# EAGLE design foxcar-control-board-v1 (EAGLE 6.4)

## Sheet 1 of 2
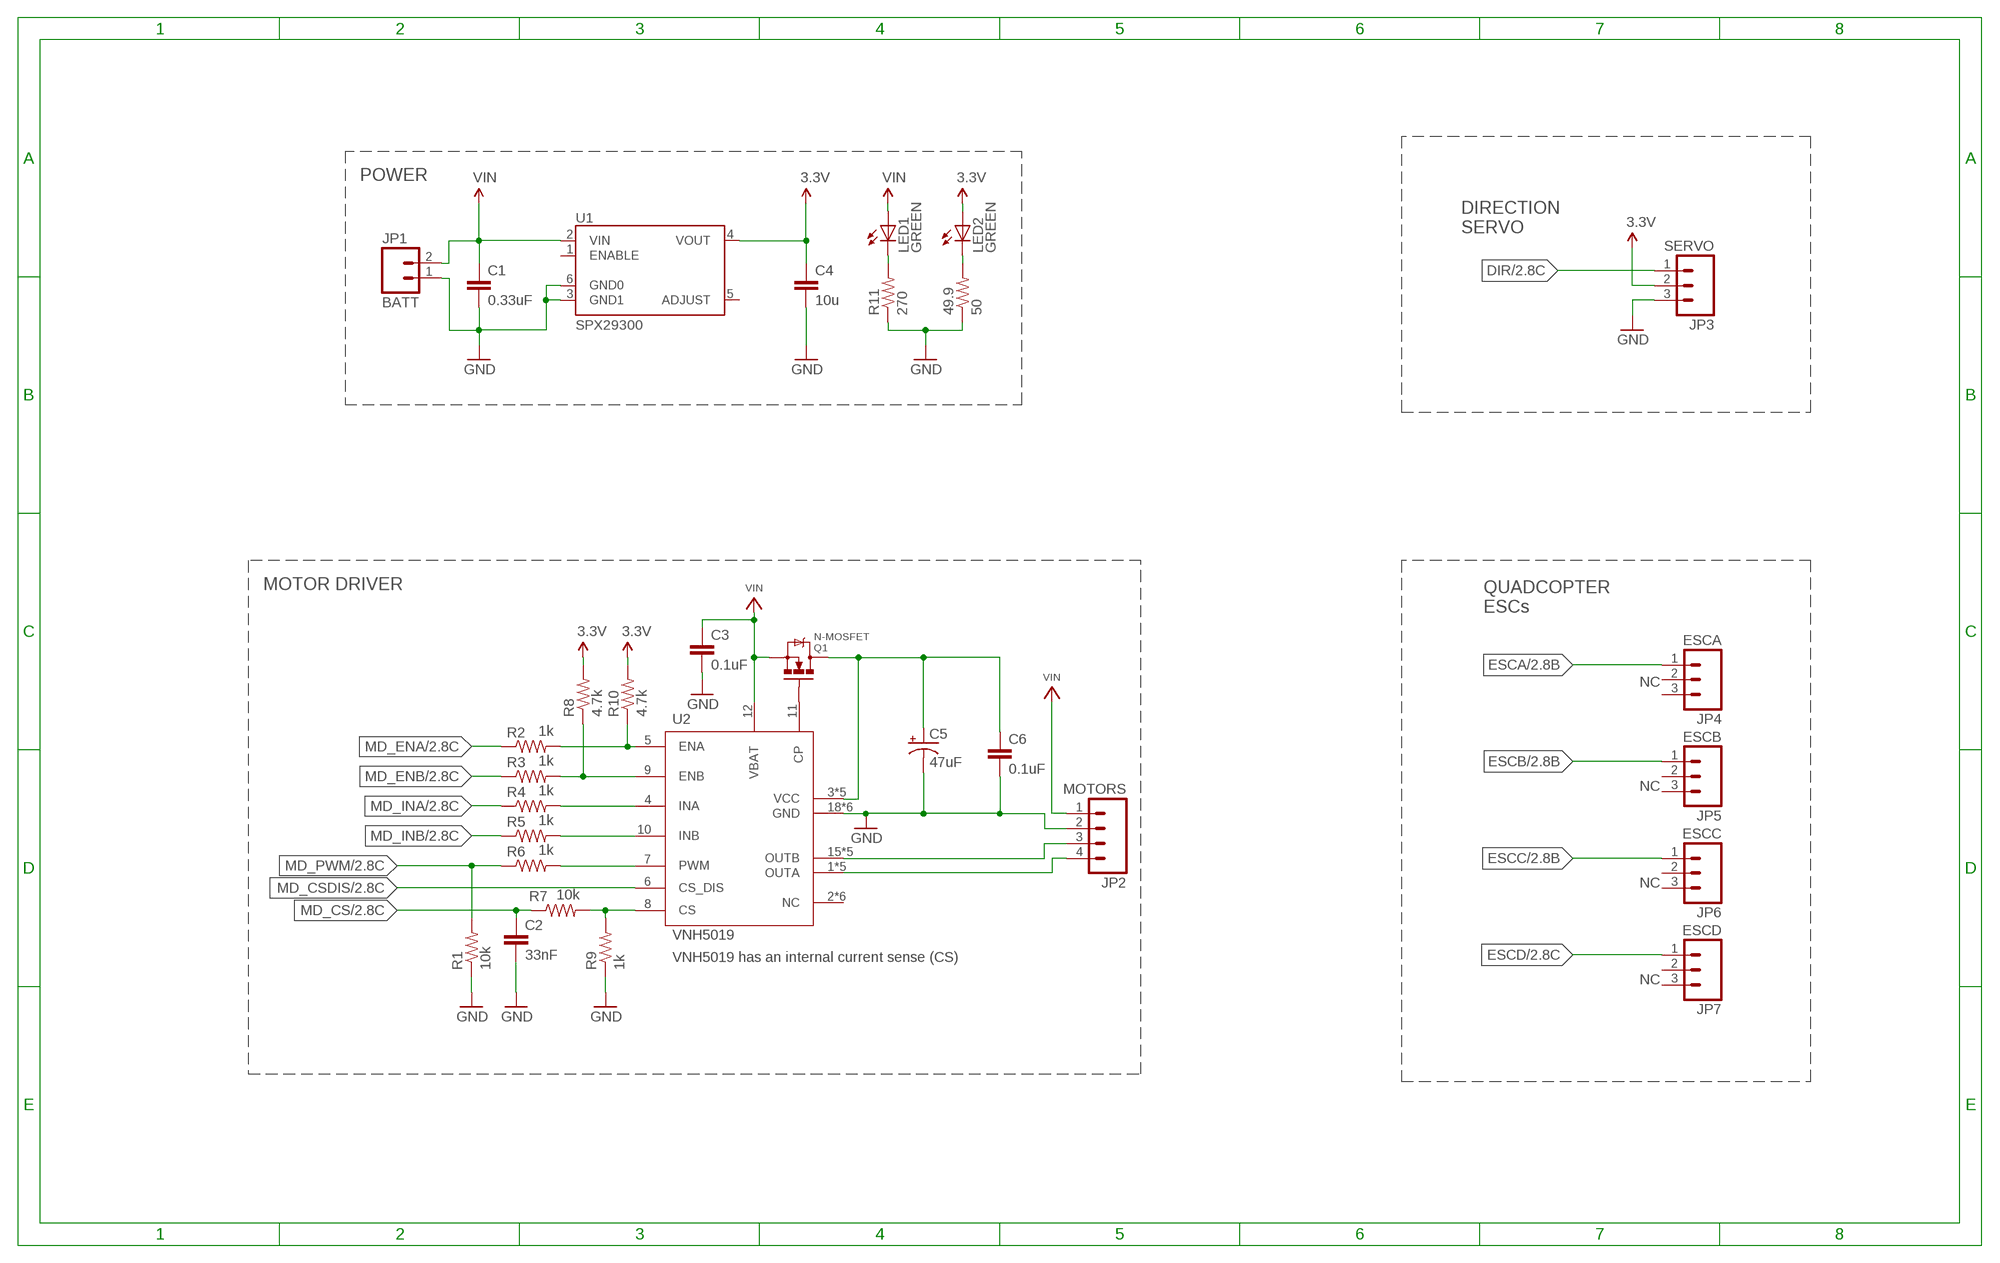
[diagram p0: schematic, sheet 1]

### Parts
49.9  50  RESISTOR0402-RES  [0402-RES]
C1  0.33uF  CAP0402-CAP  [0402-CAP]
C2  33nF  CAP0402-CAP  [0402-CAP]
C3  0.1uF  CAP0402-CAP  [0402-CAP]
C4  10u  CAP0603-CAP  [0603-CAP]
C5  47uF  CAP_POLD  [PANASONIC_D]
C6  0.1uF  CAP0402-CAP  [0402-CAP]
JP1  BATT  M023.5MM_LOCK  [SCREWTERMINAL-3.5MM-2_LOCK]
JP2  MOTORS  M04SCREW_LOCK  [SCREWTERMINAL-3.5MM-4_LOCK]
JP3  SERVO  M03LOCK_LONGPADS  [1X03_LOCK_LONGPADS]
JP4  ESCA  M03LOCK_LONGPADS  [1X03_LOCK_LONGPADS]
JP5  ESCB  M03LOCK_LONGPADS  [1X03_LOCK_LONGPADS]
JP6  ESCC  M03LOCK_LONGPADS  [1X03_LOCK_LONGPADS]
JP7  ESCD  M03LOCK_LONGPADS  [1X03_LOCK_LONGPADS]
LED1  GREEN  LEDCHIPLED_0603  [CHIPLED_0603]
LED2  GREEN  LEDCHIPLED_0603  [CHIPLED_0603]
Q1  N-MOSFET  MOSFET-NCHANNELPTH2  [TO220V]
R1  10k  RESISTOR0603-RES  [0603-RES]
R2  1k  RESISTOR0402-RES  [0402-RES]
R3  1k  RESISTOR0402-RES  [0402-RES]
R4  1k  RESISTOR0402-RES  [0402-RES]
R5  1k  RESISTOR0402-RES  [0402-RES]
R6  1k  RESISTOR0402-RES  [0402-RES]
R7  10k  RESISTOR0402-RES  [0402-RES]
R8  4.7k  RESISTOR0402-RES  [0402-RES]
R9  1k  RESISTOR0402-RES  [0402-RES]
R10  4.7k  RESISTOR0402-RES  [0402-RES]
R11  270  RESISTOR0603-RES  [0603-RES]
U1  SPX29300  VREG_TO263-5  [TO263-5]
U2  VNH5019  [MULTIPOWERSO-30]

### Nets
3.3V: C4.1 JP3.2 LED2.A R8.2 R10.2 U1.4(VOUT) ; also sheet 2
CP: Q1.1(G) U2.11(CP)
CS: R7.2 R9.2 U2.8(CS)
DIR: JP3.1 ; also sheet 2
ENA: R2.2 R10.1 U2.5(ENA)
ENB: R3.2 R8.1 U2.9(ENB)
ESCA: JP4.1 ; also sheet 2
ESCB: JP5.1 ; also sheet 2
ESCC: JP6.1 ; also sheet 2
ESCD: JP7.1 ; also sheet 2
GND: 49.9.1 C1.2 C2.2 C3.2 C4.2 C5.- C6.2 JP1.1 JP2.2 JP3.3 R1.1 R9.1 R11.1 U1.3(GND1) U1.6(GND0) U2.18(GND) U2.19(GND) U2.20(GND) U2.26(GND) U2.27(GND) U2.28(GND) ; also sheet 2
INA: R4.2 U2.4(INA)
INB: R5.2 U2.10(INB)
MD_CS: C2.1 R7.1 ; also sheet 2
MD_CSDIS: U2.6(CS_DIS) ; also sheet 2
MD_ENA: R2.1 ; also sheet 2
MD_ENB: R3.1 ; also sheet 2
MD_INA: R4.1 ; also sheet 2
MD_INB: R5.1 ; also sheet 2
MD_PWM: R1.2 R6.1 ; also sheet 2
N$2: 49.9.2 LED2.C
N$3: LED1.C R11.2
OUTA: JP2.4 U2.1(OUTA) U2.25(OUTA) U2.30(OUTA) U2.OUTA U2.OUTA@1(OUTA)
OUTB: JP2.3 U2.15(OUTB) U2.16(OUTB) U2.21(OUTB) U2.OUTB U2.OUTB@1(OUTB)
PWM: R6.2 U2.7(PWM)
VCC: C5.+ C6.1 Q1.2(D) U2.3(VCC) U2.13(VCC) U2.23(VCC) U2.VCC U2.VCC@1(VCC)
VIN: C1.1 C3.1 JP1.2 JP2.1 LED1.A Q1.3(S) U1.2(VIN) U2.12(VBAT) ; also sheet 2
Unconnected: JP4.2 JP4.3 JP5.2 JP5.3 JP6.2 JP6.3 JP7.2 JP7.3 U1.1(ENABLE) U1.5(ADJUST) U2.2(NC) U2.14(NC) U2.17(NC) U2.22(NC) U2.24(NC) U2.29(NC)

### Notes on the sheet
- POWER
- DIRECTION
  SERVO
- MOTOR DRIVER
- QUADCOPTER
  ESCs
- NC
- NC
- NC
- VNH5019 has an internal current sense (CS)
- NC

## Sheet 2 of 2
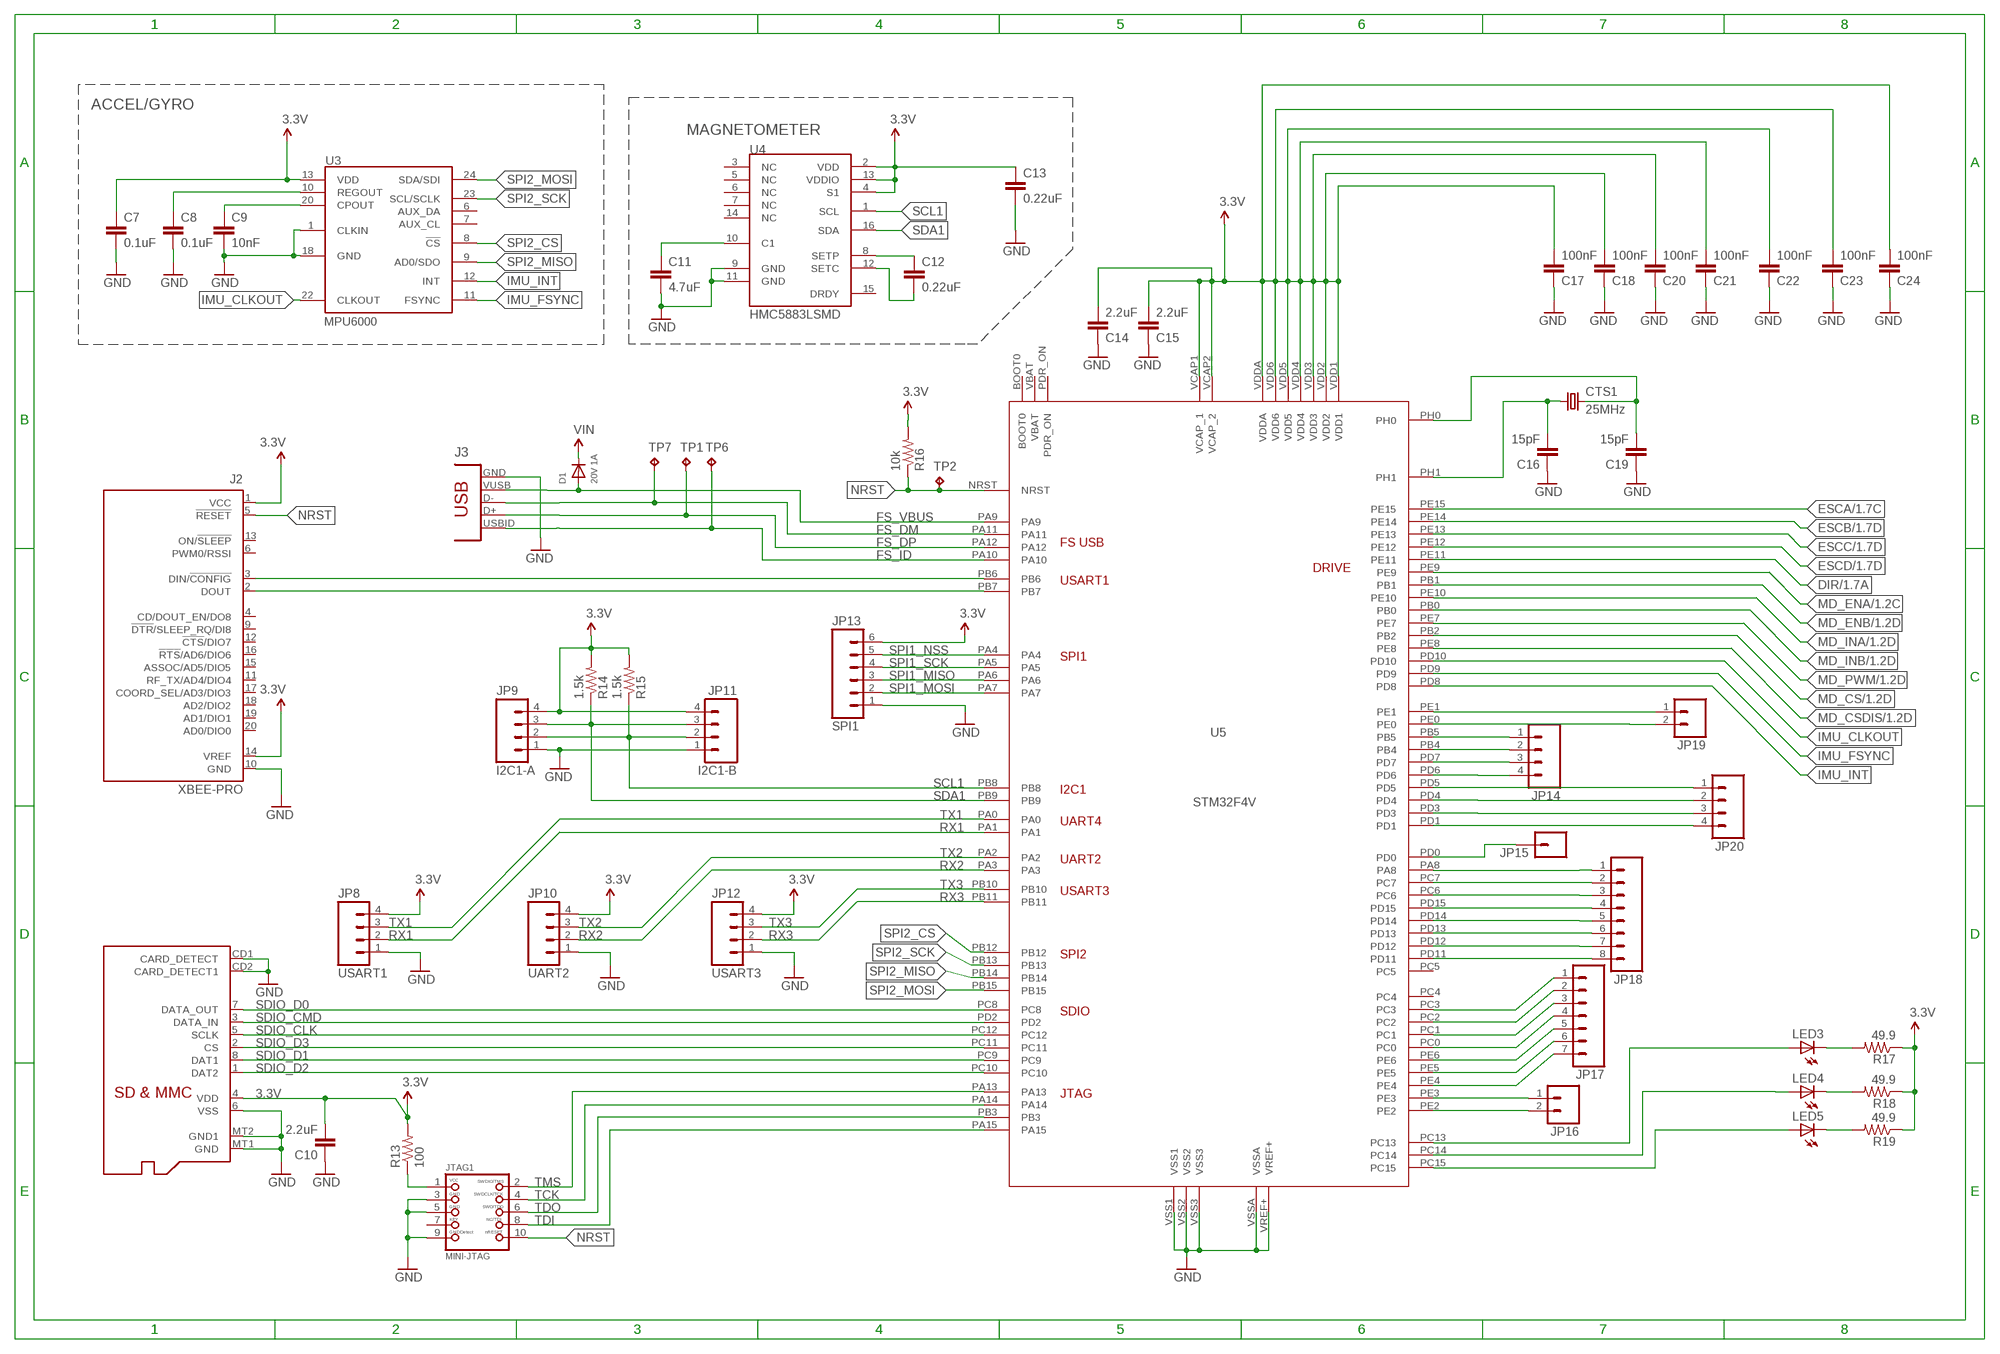
[diagram p1: schematic, sheet 2]

### Parts
C7  0.1uF  CAP0402-CAP  [0402-CAP]
C8  0.1uF  CAP0402-CAP  [0402-CAP]
C9  10nF  CAP0402-CAP  [0402-CAP]
C10  2.2uF  CAP0402-CAP  [0402-CAP]
C11  4.7uF  CAP0402-CAP  [0402-CAP]
C12  0.22uF  CAP0402-CAP  [0402-CAP]
C13  0.22uF  CAP0402-CAP  [0402-CAP]
C14  2.2uF  CAP0402-CAP  [0402-CAP]
C15  2.2uF  CAP0402-CAP  [0402-CAP]
C16  15pF  CAP0402-CAP  [0402-CAP]
C17  100nF  CAP0402-CAP  [0402-CAP]
C18  100nF  CAP0402-CAP  [0402-CAP]
C19  15pF  CAP0402-CAP  [0402-CAP]
C20  100nF  CAP0402-CAP  [0402-CAP]
C21  100nF  CAP0402-CAP  [0402-CAP]
C22  100nF  CAP0402-CAP  [0402-CAP]
C23  100nF  CAP0402-CAP  [0402-CAP]
C24  100nF  CAP0402-CAP  [0402-CAP]
CTS1  25MHz  CRYSTALCTS406  [CTS406]
D1  20V 1A  DIODESMA  [SMADIODE]
J1  MICROSD  [MICROSD]
J2  XBEE-PRO  [XBEE-PRO]
J3  CON-USB-F-MICRO-B  [CONN_USB_MICRO-B]
JP8  USART1  M04LOCK_LONGPADS  [1X04_LOCK_LONGPADS]
JP9  I2C1-A  M04LOCK_LONGPADS  [1X04_LOCK_LONGPADS]
JP10  UART2  M04LOCK_LONGPADS  [1X04_LOCK_LONGPADS]
JP11  I2C1-B  M04LOCK_LONGPADS  [1X04_LOCK_LONGPADS]
JP12  USART3  M04LOCK_LONGPADS  [1X04_LOCK_LONGPADS]
JP13  SPI1  M06LOCK_LONGPADS  [1X06_LOCK_LONGPADS]
JP14  M04LOCK  [1X04_LOCK]
JP15  M01PTH  [1X01]
JP16  M02LOCK_LONGPADS  [1X02_LOCK_LONGPADS]
JP17  M07LOCK  [1X07_LOCK]
JP18  M08LOCK_LONGPADS  [1X08_LOCK_LONGPADS]
JP19  M02LOCK  [1X02_LOCK]
JP20  M04LOCK  [1X04_LOCK]
JTAG1  MINI-JTAG  JTAG-CORTEXM3  [2X05_1.27MM_SMT]
LED3  LEDCHIPLED_0603  [CHIPLED_0603]
LED4  LEDCHIPLED_0603  [CHIPLED_0603]
LED5  LEDCHIPLED_0603  [CHIPLED_0603]
R13  100  RESISTOR0402-RES  [0402-RES]
R14  1.5k  RESISTOR0402-RES  [0402-RES]
R15  1.5k  RESISTOR0402-RES  [0402-RES]
R16  10k  RESISTOR0402-RES  [0402-RES]
R17  49.9  RESISTOR0402-RES  [0402-RES]
R18  49.9  RESISTOR0402-RES  [0402-RES]
R19  49.9  RESISTOR0402-RES  [0402-RES]
TP1  TPTP06R  [TP06R]
TP2  TPTP06R  [TP06R]
TP6  TPTP06R  [TP06R]
TP7  TPTP06R  [TP06R]
U3  MPU6000  MPU-6000  [QFN.24.4X4]
U4  HMC5883LSMD  [16LPCC]
U5  STM32F4V  STM32F4V_100PIN_FOXCAR  [LQFP100]

### Nets
3.3V: C7.1 C10.2 C13.1 C14.2 C15.2 C17.2 C18.2 C20.2 C21.2 C22.2 C23.2 C24.2 J1.4(VDD) J2.1(VCC) J2.14(VREF) JP8.4 JP9.4 JP10.4 JP11.4 JP12.4 JP13.6 R13.2 R14.2 R15.2 R16.2 R17.1 R18.1 R19.1 U3.13(VDD) U4.2(VDD) U4.4(S1) U4.13(VDDIO) U5.VCAP1(VCAP_1) U5.VCAP2(VCAP_2) U5.VDD1 U5.VDD2 U5.VDD3 U5.VDD4 U5.VDD5 U5.VDD6 U5.VDDA ; also sheet 1
DIR: U5.PE11 ; also sheet 1
ESCA: U5.PE15 ; also sheet 1
ESCB: U5.PE14 ; also sheet 1
ESCC: U5.PE13 ; also sheet 1
ESCD: U5.PE12 ; also sheet 1
FS_DM: J3.P2(D-) TP7.TP U5.PA11
FS_DP: J3.P3(D+) TP1.TP U5.PA12
FS_ID: J3.P4(USBID) TP6.TP U5.PA10
FS_VBUS: D1.A J3.P1(VUSB) U5.PA9
GND: C7.2 C8.2 C9.2 C10.1 C11.2 C13.2 C14.1 C15.1 C16.1 C17.1 C18.1 C19.1 C20.1 C21.1 C22.1 C23.1 C24.1 J1.6(VSS) J1.CD1(CARD_DETECT) J1.CD2(CARD_DETECT1) J1.MT1(GND) J1.MT2(GND1) J2.10(GND) J3.P5(GND) JP8.1 JP9.1 JP10.1 JP11.1 JP12.1 JP13.1 JTAG1.3 JTAG1.5 JTAG1.9 U3.1(CLKIN) U3.18(GND) U4.9(GND) U4.11(GND) U5.VREF+ U5.VSS1 U5.VSS2 U5.VSS3 U5.VSSA ; also sheet 1
IMU_CLKOUT: U3.22(CLKOUT) U5.PD10
IMU_FSYNC: U3.11(FSYNC) U5.PD9
IMU_INT: U3.12(INT) U5.PD8
LED_B: LED5.A U5.PC15
LED_G: LED4.A U5.PC14
LED_R: LED3.A U5.PC13
MD_CS: U5.PB2 ; also sheet 1
MD_CSDIS: U5.PE8 ; also sheet 1
MD_ENA: U5.PE9 ; also sheet 1
MD_ENB: U5.PB1 ; also sheet 1
MD_INA: U5.PE10 ; also sheet 1
MD_INB: U5.PB0 ; also sheet 1
MD_PWM: U5.PE7 ; also sheet 1
N$1: JP18.1 U5.PA8
N$4: C12.2 U4.12(SETC)
N$5: LED3.C R17.2
N$6: LED4.C R18.2
N$7: LED5.C R19.2
N$9: JP17.4 U5.PC0
N$10: JP17.3 U5.PC1
N$11: C12.1 U4.8(SETP)
N$12: C11.1 U4.10(C1)
N$14: JP17.2 U5.PC2
N$15: JP19.1 U5.PE1
N$16: JP17.1 U5.PC3
N$18: C9.1 U3.20(CPOUT)
N$20: JTAG1.1 R13.1
N$41: JP16.2 U5.PE2
N$42: JP16.1 U5.PE3
N$43: JP17.7 U5.PE4
N$44: JP17.6 U5.PE5
N$45: JP17.5 U5.PE6
N$55: JP18.2 U5.PC7
N$56: JP18.3 U5.PC6
N$57: JP18.4 U5.PD15
N$58: JP18.5 U5.PD14
N$59: JP18.6 U5.PD13
N$60: JP18.7 U5.PD12
N$61: JP18.8 U5.PD11
N$66: JP19.2 U5.PE0
N$67: JP14.1 U5.PB5
N$68: JP14.2 U5.PB4
N$69: JP14.3 U5.PD7
N$70: JP14.4 U5.PD6
N$71: JP20.1 U5.PD5
N$72: JP20.2 U5.PD4
N$73: JP20.3 U5.PD3
N$74: JP20.4 U5.PD1
N$75: JP15.1 U5.PD0
NRST: J2.5(!RESET) JTAG1.10 R16.1 TP2.TP U5.NRST
OSC_IN1: C19.2 CTS1.3 U5.PH0
OSC_OUT1: C16.2 CTS1.1 U5.PH1
REGOUT: C8.1 U3.10(REGOUT)
RX1: JP8.2 U5.PA1
RX2: JP10.2 U5.PA3
RX3: JP12.2 U5.PB11
RX_DOUT1: J2.2(DOUT) U5.PB7
SCL1: JP9.2 JP11.2 R15.1 U4.1(SCL) U5.PB8
SDA1: JP9.3 JP11.3 R14.1 U4.16(SDA) U5.PB9
SDIO_CLK: J1.5(SCLK) U5.PC12
SDIO_CMD: J1.3(DATA_IN) U5.PD2
SDIO_D0: J1.7(DATA_OUT) U5.PC8
SDIO_D1: J1.8(DAT1) U5.PC9
SDIO_D2: J1.1(DAT2) U5.PC10
SDIO_D3: J1.2(CS) U5.PC11
SPI1_MISO: JP13.3 U5.PA6
SPI1_MOSI: JP13.2 U5.PA7
SPI1_NSS: JP13.5 U5.PA4
SPI1_SCK: JP13.4 U5.PA5
SPI2_CS: U3.8(!CS) U5.PB12
SPI2_MISO: U3.9(AD0/SDO) U5.PB14
SPI2_MOSI: U3.24(SDA/SDI) U5.PB15
SPI2_SCK: U3.23(SCL/SCLK) U5.PB13
TCK: JTAG1.4 U5.PA14
TDI: JTAG1.8 U5.PA15
TDO: JTAG1.6 U5.PB3
TMS: JTAG1.2 U5.PA13
TX1: JP8.3 U5.PA0
TX2: JP10.3 U5.PA2
TX3: JP12.3 U5.PB10
TX_DIN1: J2.3(DIN/!CONFIG) U5.PB6
VIN: D1.C ; also sheet 1
Unconnected: J2.4(CD/DOUT_EN/DO8) J2.6(PWM0/RSSI) J2.9(!DTR!/SLEEP_RQ/DI8) J2.11(RF_TX/AD4/DIO4) J2.12(!CTS!/DIO7) J2.13(ON/!SLEEP) J2.15(ASSOC/AD5/DIO5) J2.16(!RTS!/AD6/DIO6) J2.17(COORD_SEL/AD3/DIO3) J2.18(AD2/DIO2) J2.19(AD1/DIO1) J2.20(AD0/DIO0) J3.BODY@1(BODY) J3.BODY@2(BODY) J3.BODY@3(BODY) J3.BODY@4(BODY) JTAG1.7 U3.6(AUX_DA) U3.7(AUX_CL) U4.3(NC) U4.5(NC) U4.6(NC) U4.7(NC) U4.14(NC) U4.15(DRDY) U5.BOOT0 U5.PC4 U5.PC5 U5.PDR_ON U5.VBAT

### Notes on the sheet
- ACCEL/GYRO
- MAGNETOMETER

## Library data of the parts
49.9 R1-R11 R13-R19 = SparkFun-Passives:RESISTOR: Resistor Basic schematic elements and footprints for 0603, 1206, and PTH resistors.
C1-C4 C6-C24 = SparkFun-Passives:CAP: Capacitor Standard 0603 ceramic capacitor, and 0.1" leaded capacitor.
C5 = SparkFun-Passives:CAP_POL: Capacitor Polarized These are standard SMD and PTH capacitors. Normally 10uF, 47uF, and 100uF in electrolytic and tantalum varieties. Always verify the external diameter of the through hole cap, it varies with capacity, voltage, and manufacturer. The EIA devices should be standard.
CTS1 = crystal:CRYSTAL: CRYSTAL; OC_FARNELL: unknown; OC_NEWARK: unknown
D1 = adafruit:DIODE: Diode SMADIODE - SMA Surface Mount Package 20V 1A Schottky Diode Digikey: 641-1014-6-ND DO-1N4148 - Through Hole Small Current Diode SOD-123 20V 1 A (.5mV Vf) Schottky Diode - Digikey: MBRX120TPMSCT-ND SOD-323 10V 570mA (.38mV Vf, 3ns) Schottky Diode - Digikey: ZLLS410CT-ND SOD-523 30V 30mA Schottky Diode (RB751S-40TE61) - Digikey: RB751S-40TE61CT-ND SOT23-R/W - SOT23 Package (R = Solder Paste/Reflow Ovens, W = Hand-Soldering) BAT54Film 40V 300mA - Digikey: 497-7162-1-ND
J1 = adafruit:MICROSD: Micro-SD / Transflash card holder with SPI pinout For the 3M # 2908-05WB-MG and/or 4UCON #19656 push-push type
J2 = maxstream:XBEE: XBee (TM) /XBee-PRO(TM) OEM RF Modules Source: MaxStream, Inc. xbee_productmanual.pdf; MPN: XBP24-AWI-001; OC_FARNELL: 1337916; OC_NEWARK: 42M2667
J3 = dp_devices:CON-USB-F: USB Female connector
JP1 JP16 JP19 = SparkFun-Connectors:M02: Header 2 Standard 2-pin 0.1" header. Use with straight break away headers (SKU : PRT-00116), right angle break away headers (PRT-00553), swiss pins (PRT-00743), machine pins (PRT-00117), and female headers (PRT-00115). Molex polarized connector foot print use with SKU : PRT-08233 with associated crimp pins and housings.
JP2 JP8-JP12 JP14 JP20 = SparkFun-Connectors:M04: Header 4 Standard 4-pin 0.1" header. Use with straight break away headers (SKU : PRT-00116), right angle break away headers (PRT-00553), swiss pins (PRT-00743), machine pins (PRT-00117), and female headers (PRT-00115). Molex polarized connector foot print use with SKU : PRT-08231 with associated crimp pins and housings. 1MM SMD Version SKU: PRT-10208
JP3-JP7 = SparkFun-Connectors:M03: Header 3 Standard 3-pin 0.1" header. Use with straight break away headers (SKU : PRT-00116), right angle break away headers (PRT-00553), swiss pins (PRT-00743), machine pins (PRT-00117), and female headers (PRT-00115). Molex polarized connector foot print use with SKU : PRT-08232 with associated crimp pins and housings.
JP13 = SparkFun-Connectors:M06: Header 6 Standard 6-pin 0.1" header. Use with straight break away headers (SKU : PRT-00116), right angle break away headers (PRT-00553), swiss pins (PRT-00743), machine pins (PRT-00117), and female headers (PRT-00115). Molex polarized connector foot print use with SKU : PRT-08094 with associated crimp pins and housings. NOTES ON THE VARIANTS LOCK and LOCK_LONGPADS... This footprint was designed to help hold the alignment of a through-hole component (i.e. 6-pin header) while soldering it into place. You may notice that each hole has been shifted either up or down by 0.005 of an inch from it's more standard position (which is a perfectly straight line). This slight alteration caused the pins (the squares in the middle) to touch the edges of the holes. Because they are alternating, it causes a "brace" to hold the component in place. 0.005 has proven to be the perfect amount of "off-center" position when using our standard breakaway headers. Although looks a little odd when you look at the bare footprint, once you have a header in there, the alteration is very hard to notice. Also, if you push a header all the way into place, it is covered up entirely on the bottom side. This idea of altering the position of holes to aid alignment will be further integrated into the Sparkfun Library for other footprints. It can help hold any component with 3 or more connection pins.
JP15 = SparkFun-Connectors:M01: Header 1 Standard 1-pin 0.1" header. Use with straight break away headers (SKU : PRT-00116), right angle break away headers (PRT-00553), swiss pins (PRT-00743), machine pins (PRT-00117), and female headers (PRT-00115).
JP17 = SparkFun-Connectors:M07: Header 7 Standard 7-pin 0.1" header. Use with straight break away headers (SKU : PRT-00116), right angle break away headers (PRT-00553), swiss pins (PRT-00743), machine pins (PRT-00117), and female headers (PRT-00115). NOTES ON THE VARIANTS LOCK and LOCK_LONGPADS... This footprint was designed to help hold the alignment of a through-hole component (i.e. 7-pin header) while soldering it into place. You may notice that each hole has been shifted either up or down by 0.005 of an inch from it's more standard position (which is usually a perfectly straight line). This slight alteration caused the pins (the squares in the middle) to touch the edges of the holes. Because they are alternating, it causes a "brace" to hold the header in place. 0.005 has proven to be the perfect amount of "off-center" position when using our standard breakaway headers. Although looks a little odd when you look at the bare footprint, once you have a header in there, the alteration is very hard to notice. Also, if you push a header all the way into place, it is covered up entirely on the bottom side. This idea of altering the position of holes to aid alignment will be further integrated into the Sparkfun Library for other footprints. It can help hold any component with 3 or more connection pins.
JP18 = SparkFun-Connectors:M08: Header 8 Standard 8-pin 0.1" header. Use with straight break away headers (SKU : PRT-00116), right angle break away headers (PRT-00553), swiss pins (PRT-00743), machine pins (PRT-00117), and female headers (PRT-00115).
JTAG1 = microbuilder:JTAG-CORTEXM3: Serial Wire (SW-DP) Connector This standard 0.05" 10-pin connector is for use with the Cortex M0/M3's native SWD (serial wire debugger) interface (SW-DP). Some boards support a 20-pin combined JTAG+SWD connector (SWJ-DP), such as the LPC1700 family, but many smaller devices only work with SWD which typically use the smaller 10-pin SW-DP connecter (the LPC1300 family, for example, only supports SWD). 2x05 1.27mm/0.05" Connector: This is the standard SMT connector defined by ARM for all Cortex devices, and should be used in most situations and for forward-compatibility since any new devices coming to market will likely use this connector. MOLEX 10 Pin 0.1" Connector: This 0.1" 10 pin connector has the same pin layout as the standard 0.05" connector, but is easier to work with if you are using standard jumper wires or custom cables to connect your SWD hardware. MOLEX 20 Pin 0.1" Connector: This 0.1" 20 pin connector is the same model used for ARM7/ARM9 JTAG debuggers, but is connected to match the pins on the Segger J-Link for ARM (which supports both JTAG and SWD debugging). See the following document from ARM for more information on Cortex M3 Debug Connectors: http://infocenter.arm.com/help/topic/com.arm.doc.faqs/attached/13634/cortex_debug_connectors.pdf And the following page for an overview with images of the different connector types: http://www.keil.com/peripherals/coresight/connectors.asp
LED1-LED5 = led:LED: LED OSRAM: - CHIPLED LG R971, LG N971, LY N971, LG Q971, LY Q971, LO R971, LY R971 LH N974, LH R974 LS Q976, LO Q976, LY Q976 LO Q996 - Hyper CHIPLED LW Q18S LB Q993, LB Q99A, LB R99A - SideLED LS A670, LO A670, LY A670, LG A670, LP A670 LB A673, LV A673, LT A673, LW A673 LH A674 LY A675 LS A676, LA A676, LO A676, LY A676, LW A676 LS A679, LY A679, LG A679 - Hyper Micro SIDELED® LS Y876, LA Y876, LO Y876, LY Y876 LT Y87S - SmartLED LW L88C, LW L88S LB L89C, LB L89S, LG L890 LS L89K, LO L89K, LY L89K LS L896, LA L896, LO L896, LY L896 - TOPLED LS T670, LO T670, LY T670, LG T670, LP T670 LSG T670, LSP T670, LSY T670, LOP T670, LYG T670 LG T671, LOG T671, LSG T671 LB T673, LV T673, LT T673, LW T673 LH T674 LS T676, LA T676, LO T676, LY T676, LB T676, LH T676, LSB T676, LW T676 LB T67C, LV T67C, LT T67C, LS T67K, LO T67K, LY T67K, LW E67C LS E67B, LA E67B, LO E67B, LY E67B, LB E67C, LV E67C, LT E67C LW T67C LS T679, LY T679, LG T679 LS T770, LO T770, LY T770, LG T770, LP T770 LB T773, LV T773, LT T773, LW T773 LH T774 LS E675, LA E675, LY E675, LS T675 LS T776, LA T776, LO T776, LY T776, LB T776 LHGB T686 LT T68C, LB T68C - Hyper Mini TOPLED® LB M676 - Mini TOPLED Santana® LG M470 LS M47K, LO M47K, LY M47K Source: http://www.osram.convergy.de LUXEON: - LUMILED® LXK2-PW12-R00, LXK2-PW12-S00, LXK2-PW14-U00, LXK2-PW14-V00 LXK2-PM12-R00, LXK2-PM12-S00, LXK2-PM14-U00 LXK2-PE12-Q00, LXK2-PE12-R00, LXK2-PE12-S00, LXK2-PE14-T00, LXK2-PE14-U00 LXK2-PB12-K00, LXK2-PB12-L00, LXK2-PB12-M00, LXK2-PB14-N00, LXK2-PB14-P00, LXK2-PB14-Q00 LXK2-PR12-L00, LXK2-PR12-M00, LXK2-PR14-Q00, LXK2-PR14-R00 LXK2-PD12-Q00, LXK2-PD12-R00, LXK2-PD12-S00 LXK2-PH12-R00, LXK2-PH12-S00 LXK2-PL12-P00, LXK2-PL12-Q00, LXK2-PL12-R00 Source: www.luxeon.com KINGBRIGHT: KA-3528ASYC Source: www.kingbright.com
Q1 = SparkFun-DiscreteSemi:MOSFET-NCHANNEL: Generic NMOS footprint
TP1 TP2 TP6 TP7 = testpad:TP: Test pad
U1 = microbuilder:VREG_TO263-5: TO263-5 Linear Voltage Regulators LD29300xx - 3A LDO (Vf: 0.4V@3A, 0.2V@1A) - Digikey: 3.3V - 497-3475-1-ND
U2 = wicker:VNH5019
U3 = invensense:MPU-6000
U4 = SparkFun-Sensors:HMC5883L: 3 Axis Digital Compass IC
U5 = stm32f4:STM32F4V_100PIN_FOXCAR

## Board
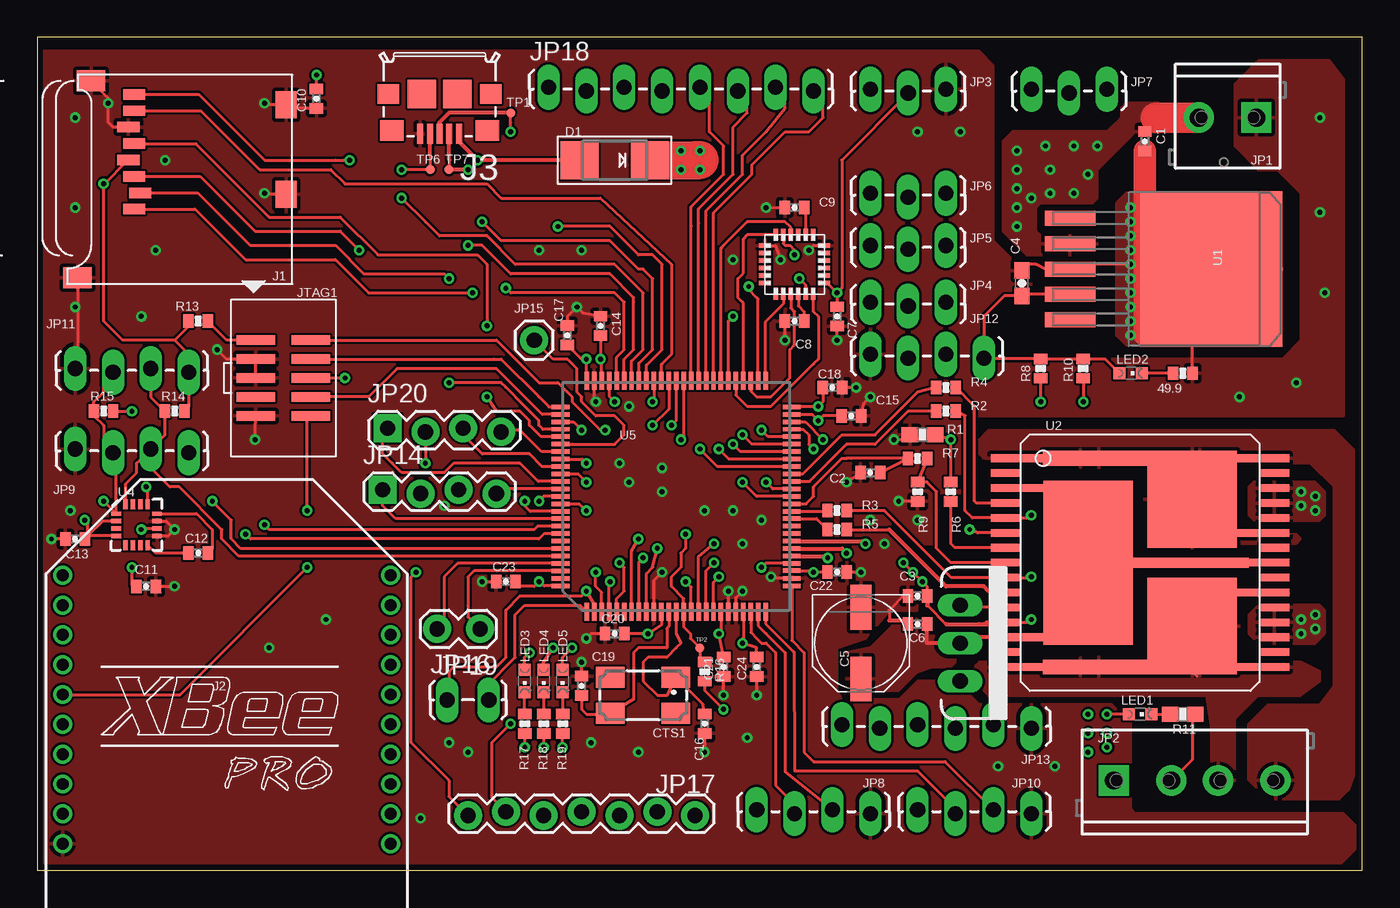
[diagram p2: board, top side]
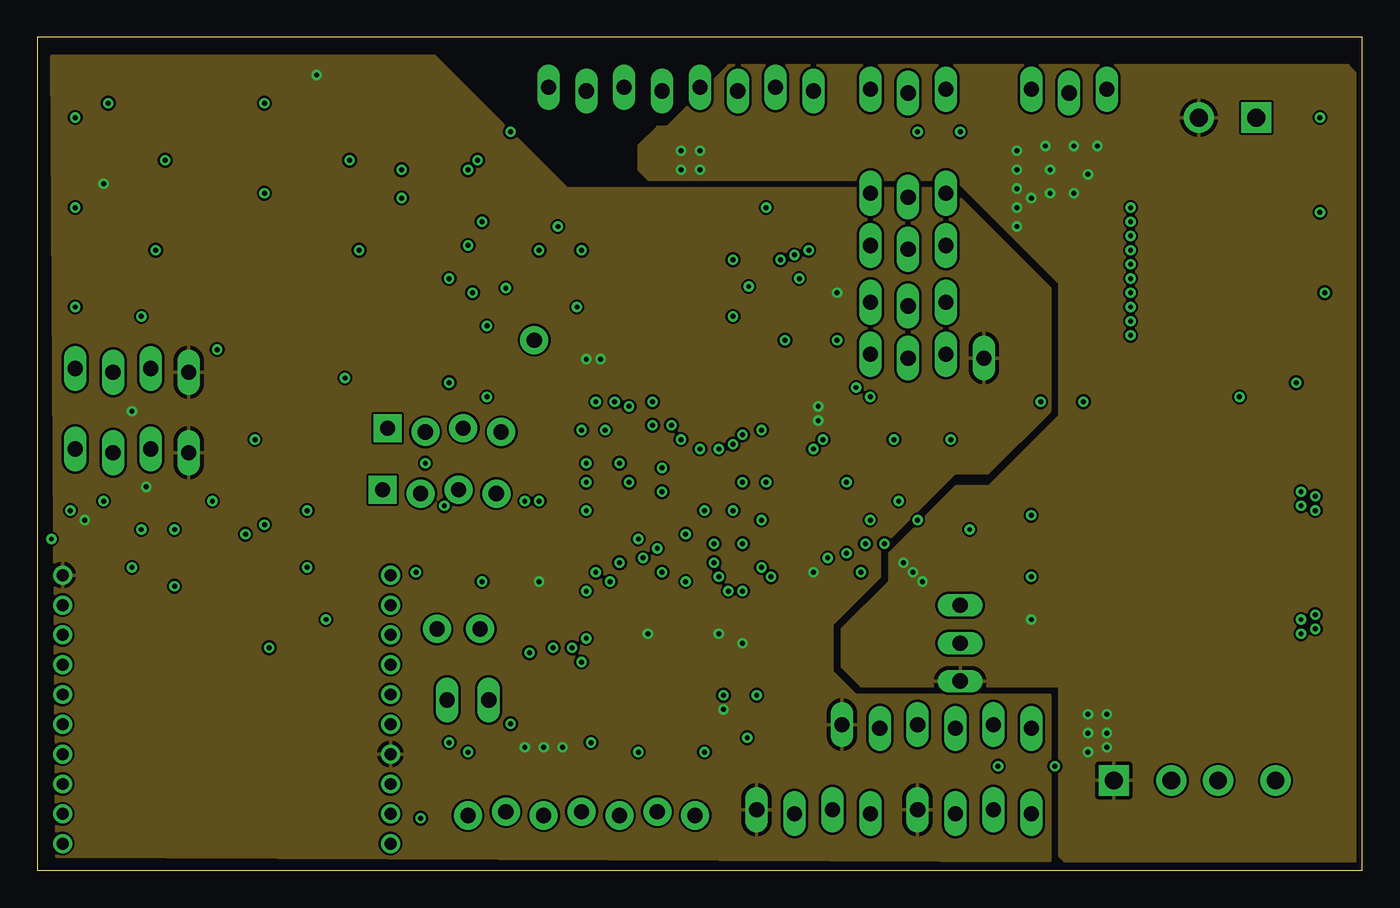
[diagram p3: board, inner layer PWR]
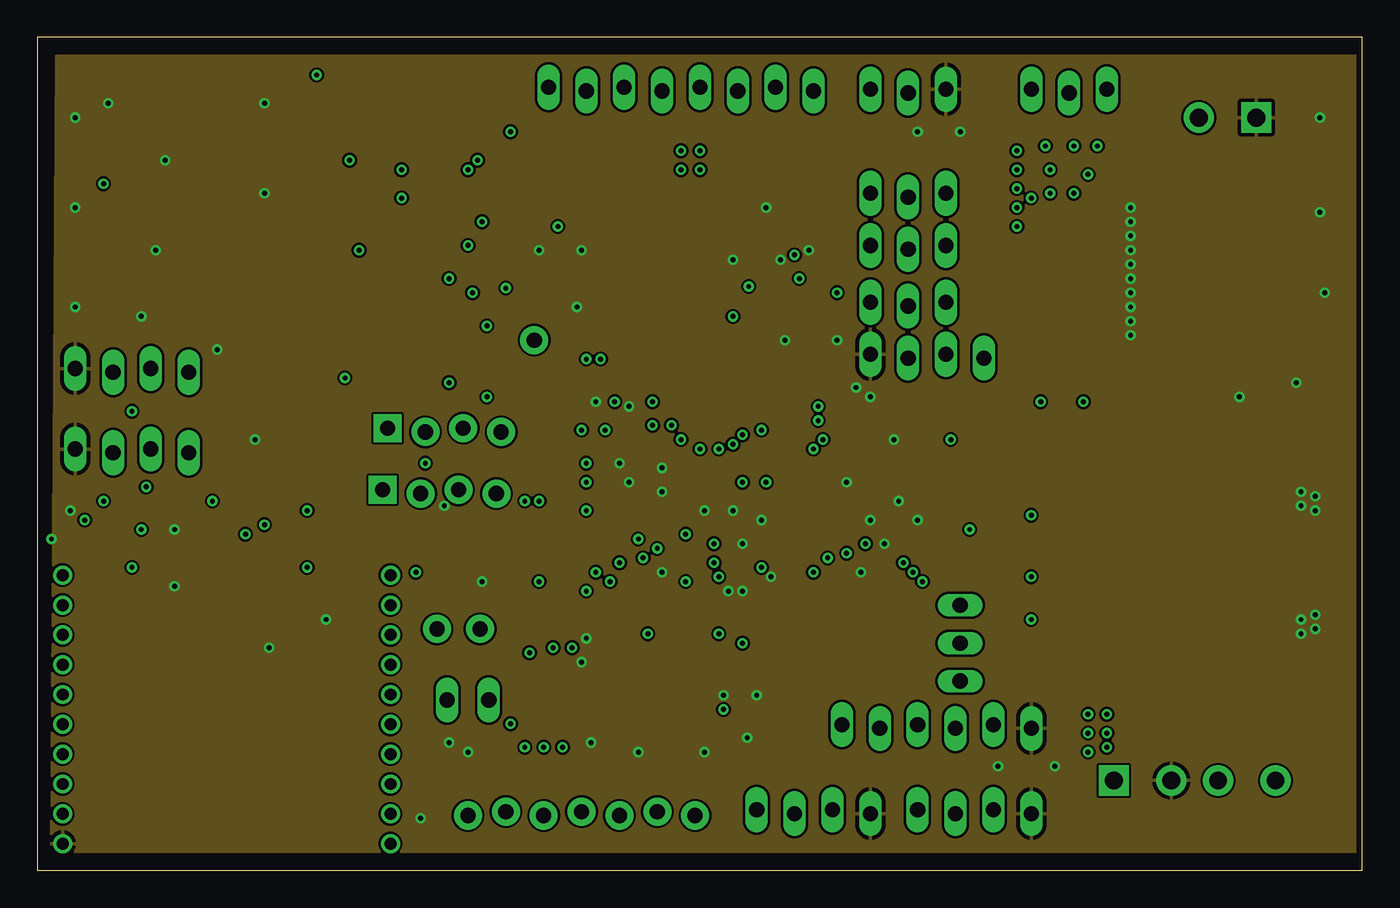
[diagram p4: board, inner layer GND]
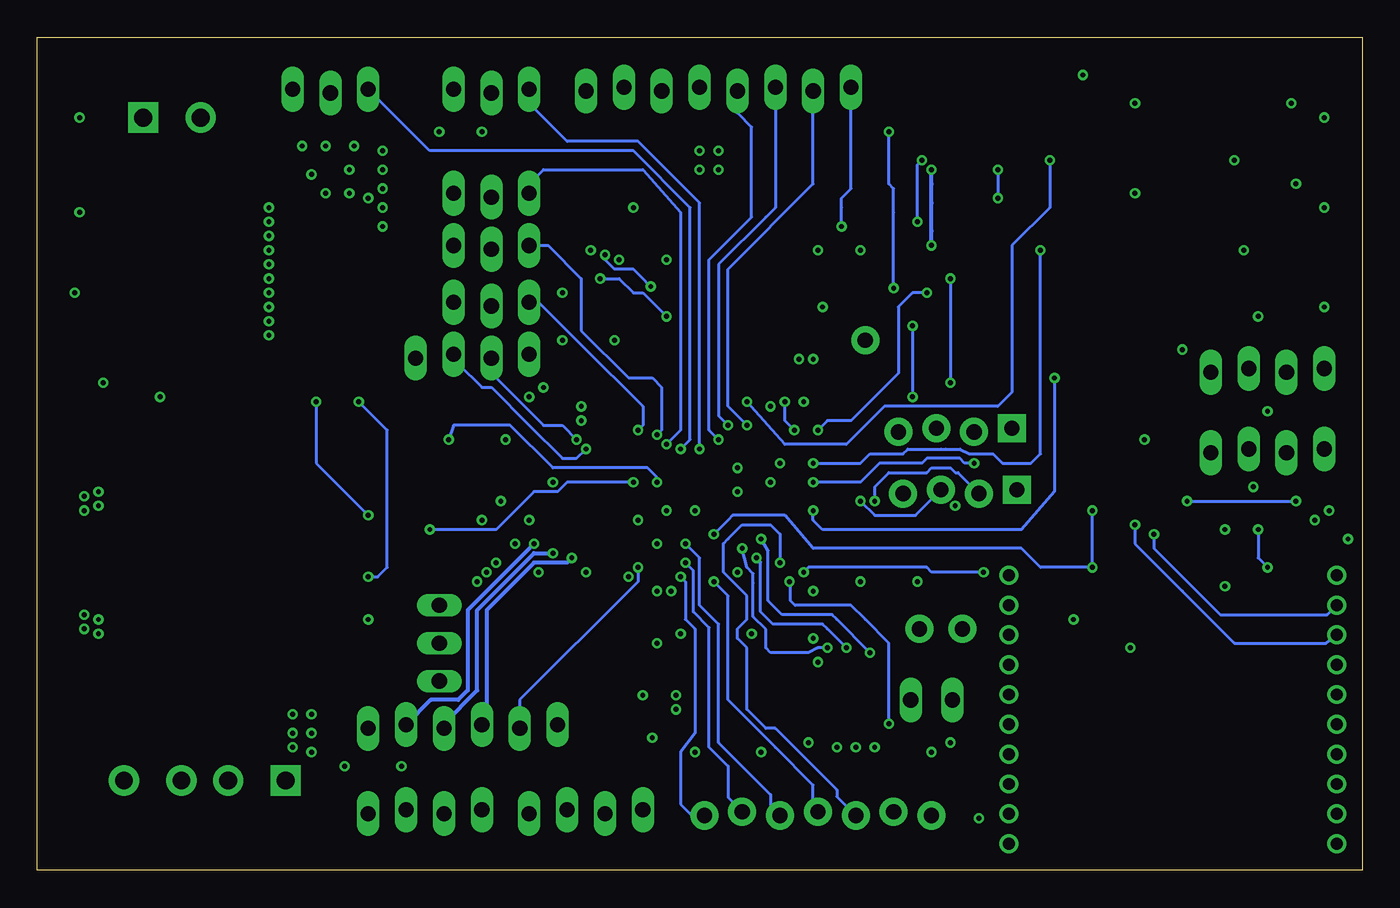
[diagram p5: board, bottom side, seen from below]

Size 88.88 x 55.87 mm. Coordinates in mm from the lower left corner, seen from the top.
Outline: 0,0 88.88,0 88.88,55.87 0,55.87 0,0
Copper layers (1*2*15*16): Top 0.0356mm / dielectric 1.5011mm / PWR 0.0356mm / dielectric 0.1499mm / GND 0.0356mm / dielectric 0.2007mm / Bottom 0.0356mm
Design rules "LaenPCBOrder *": minimum track width 6mil, minimum drill 13mil, track to track 6mil, track to pad 6mil, pad to pad 6mil, via to via 6mil, smd to smd 6mil, copper to edge 15mil, drill to drill 6mil, minimum pad ring 7mil, minimum via ring 7mil, stop-mask expansion 3mil, vias tented up to drill 0mil, thermal gap 10mil

### Footprints (pad centres in the part's own frame; a part is rotated, then mirrored left to right if it is on the bottom)
0402-RES = smd 0.7 x 0.9: 1 -0.65,0; 2 0.65,0
0402-CAP = smd 0.7 x 0.9: 1 -0.65,0; 2 0.65,0
0603-CAP = smd 1.1 x 1: 1 -0.85,0; 2 0.85,0
PANASONIC_D = smd 3 x 1.4: + 2.4,0; - -2.4,0
CTS406 = smd 1.9 x 1.4: 1 -2.2,-1.2; 2 2.2,-1.2; 3 2.2,1.2; 4 -2.2,1.2
SMADIODE = smd 2.54 x 2.54: A 2.349,0; C -2.349,0
MICROSD = smd 0.7 x 1.5: 1 9,-10.64; 2 7.9,-10.24; 3 6.8,-10.64; 4 5.7,-11.04; 5 4.6,-10.64; 6 3.5,-11.04; 7 2.4,-10.64; 8 1.3,-10.64 | smd 1.8 x 1.4: CD1 2,-0.44; CD2 8,-0.44 | smd 1.4 x 1.9: MT1 0.4,-13.54; MT2 13.6,-14.44
XBEE-PRO = drill 0.8 pad 1.27: 1 -11,9; 2 -11,7; 3 -11,5; 4 -11,3; 5 -11,1; 6 -11,-1; 7 -11,-3; 8 -11,-5; 9 -11,-7; 10 -11,-9; 11 11,-9; 12 11,-7; 13 11,-5; 14 11,-3; 15 11,-1; 16 11,1; 17 11,3; 18 11,5; 19 11,7; 20 11,9
CONN_USB_MICRO-B = smd 1.6 x 1.4: BODY@1 -3.2,2.45; BODY@2 3.2,2.45 | smd 1.45 x 1.3: BODY@3 3.425,0; BODY@6 -3.425,0 | smd 1.9 x 1.9: BODY@4 1.2,0; BODY@5 -1.2,0 | smd 0.4 x 1.35: P1 -1.3,2.675; P2 -0.65,2.675; P3 0,2.675; P4 0.65,2.675; P5 1.3,2.675
SCREWTERMINAL-3.5MM-2_LOCK = drill 1.2 pad 2.032 square: 1 -0.178,0 | drill 1.2 pad 2.032: 2 3.678,0
SCREWTERMINAL-3.5MM-4_LOCK = drill 1.2 pad 2.032 square: 1 -0.178,0 | drill 1.2 pad 2.032: 2 3.678,0; 3 6.822,0; 4 10.678,0
1X03_LOCK_LONGPADS = drill 1.016 long: 1 0,0; 2 2.54,-0.254; 3 5.08,0
1X04_LOCK_LONGPADS = drill 1.016 long: 1 0,0; 2 2.54,-0.254; 3 5.08,0; 4 7.62,-0.254
1X06_LOCK_LONGPADS = drill 1.016 long: 1 0,0; 2 2.54,-0.254; 3 5.08,0; 4 7.62,-0.254; 5 10.16,0; 6 12.7,-0.254
1X04_LOCK = drill 1.016 pad 1.88 square: 1 0,0.127 | drill 1.016 pad 1.88: 2 2.54,-0.127; 3 5.08,0.127; 4 7.62,-0.127
1X01 = drill 1.016 pad 1.88: 1 0,0
1X02_LOCK_LONGPADS = drill 1.016 long: 1 -0.127,0; 2 2.667,0
1X07_LOCK = drill 1.016 pad 1.88: 1 0,0.127; 2 2.54,-0.127; 3 5.08,0.127; 4 7.62,-0.127; 5 10.16,0.127; 6 12.7,-0.127; 7 15.24,0.127
1X08_LOCK_LONGPADS = drill 1.016 long: 1 0,0.127; 2 2.54,-0.127; 3 5.08,0.127; 4 7.62,-0.127; 5 10.16,0.127; 6 12.7,-0.127; 7 15.24,0.127; 8 17.78,-0.127
1X02_LOCK = drill 1.016 pad 1.88: 1 -0.178,0; 2 2.718,0
2X05_1.27MM_SMT = smd 0.65 x 2.6: 1 -2.54,-1.85; 2 -2.54,1.85; 3 -1.27,-1.85; 4 -1.27,1.85; 5 0,-1.85; 6 0,1.85; 7 1.27,-1.85; 8 1.27,1.85; 9 2.54,-1.85; 10 2.54,1.85
CHIPLED_0603 = smd 0.8 x 0.8: A 0,-0.75; C 0,0.75
TO220V = drill 1.016 long: 1 -2.54,0; 2 0,0; 3 2.54,0
0603-RES = smd 1.1 x 1: 1 -0.85,0; 2 0.85,0
TP06R = smd 0.6 x 0.6: TP 0,0
TO263-5 = smd 1 x 3.4: 1 -3.4,-7.875; 2 -1.7,-7.875; 3 0,-7.875; 4 1.7,-7.875; 5 3.4,-7.875 | smd 10.414 x 9.525: 6 0,1.595
MULTIPOWERSO-30 = smd 0.508 x 12: 1 -7,-4; 15 7,-4; 16 7,4; 30 -7,4 | smd 0.508 x 2: 2 -6,-9; 4 -4,-9; 5 -3,-9; 6 -2,-9; 7 -1,-9; 8 0,-9; 9 1,-9; 10 2,-9; 11 3,-9; 12 4,-9; 14 6,-9; 17 6,9; 18 5,9; 19 4,9; 20 3,9; 22 1,9; 24 -1,9; 26 -3,9; 27 -4,9; 28 -5,9; 29 -6,9 | smd 0.508 x 4: 3 -5,-8; 13 5,-8; 21 2,8; 23 0,8; 25 -2,8 | smd 6.5 x 6: OUTA -4.25,3.5; OUTB 4.25,3.5 | smd 1 x 7.5: OUTA@1 -7,-2.755; OUTB@1 7,-2.755 | smd 11 x 6: VCC 0,-3.5 | smd 0.65 x 8.3: VCC@1 0,3.145
QFN.24.4X4 = smd 0.8 x 0.3: 1 -1.975,1.25; 2 -1.975,0.75; 3 -1.975,0.25; 4 -1.975,-0.25; 5 -1.975,-0.75; 6 -1.975,-1.25; 13 1.975,-1.25; 14 1.975,-0.75; 15 1.975,-0.25; 16 1.975,0.25; 17 1.975,0.75; 18 1.975,1.25 | smd 0.3 x 0.8: 7 -1.25,-1.975; 8 -0.75,-1.975; 9 -0.25,-1.975; 10 0.25,-1.975; 11 0.75,-1.975; 12 1.25,-1.975; 19 1.25,1.975; 20 0.75,1.975; 21 0.25,1.975; 22 -0.25,1.975; 23 -0.75,1.975; 24 -1.25,1.975
16LPCC = smd 0.65 x 0.28: 1 -1.37,0.75; 2 -1.37,0.25; 3 -1.37,-0.25; 4 -1.37,-0.75; 9 1.37,-0.75; 10 1.37,-0.25; 11 1.37,0.25; 12 1.37,0.75 | smd 0.28 x 0.65: 5 -0.75,-1.37; 6 -0.25,-1.37; 7 0.25,-1.37; 8 0.75,-1.37; 13 0.75,1.37; 14 0.25,1.37; 15 -0.25,1.37; 16 -0.75,1.37
LQFP100 = smd 1.2 x 0.3: BOOT0 -7.75,-3; PA3 7.75,-6.016; PA4 7.75,-4.5; PA5 7.75,-4; PA6 7.75,-3.5; PA7 7.75,-3; PA14 -7.75,6; PA15 -7.75,5.5; PB0 7.75,-1.5; PB1 7.75,-1; PB2 7.75,-0.5; PB3 -7.75,-0.5; PB4 -7.75,-1; PB5 -7.75,-1.5; PB6 -7.75,-2; PB7 -7.75,-2.5; PB8 -7.75,-3.5; PB9 -7.75,-4; PB10 7.75,4.5; PB11 7.75,5; PC4 7.75,-2.5; PC5 7.75,-2; PC10 -7.75,5; PC11 -7.75,4.5; PC12 -7.75,4; PD0 -7.75,3.5; PD1 -7.75,3; PD2 -7.75,2.5; PD3 -7.75,2; PD4 -7.75,1.5; PD5 -7.75,1; PD6 -7.75,0.5; PD7 -7.75,0; PDR_ON -7.75,-5.5; PE0 -7.75,-4.5; PE1 -7.75,-5; PE7 7.75,0; PE8 7.75,0.5; PE9 7.75,1; PE10 7.75,1.5; PE11 7.75,2; PE12 7.75,2.5; PE13 7.75,3; PE14 7.75,3.5; PE15 7.75,4; VCAP1 7.75,5.5; VDD3 7.75,-4.984; VDD4 7.75,6; VDD6 -7.75,-6; VSS2 7.75,-5.5 | smd 0.3 x 1.2: NRST 0.5,-7.75; PA0 5,-7.75; PA1 5.5,-7.75; PA2 6,-7.75; PA8 -2,7.75; PA9 -2.5,7.75; PA10 -3,7.75; PA11 -3.5,7.75; PA12 -4,7.75; PA13 -4.5,7.75; PB12 6,7.75; PB13 5.5,7.75; PB14 5,7.75; PB15 4.5,7.75; PC0 1,-7.75; PC1 1.5,-7.75; PC2 2,-7.75; PC3 2.5,-7.75; PC6 0,7.75; PC7 -0.5,7.75; PC8 -1,7.75; PC9 -1.5,7.75; PC13 -3,-7.75; PC14 -2.5,-7.75; PC15 -2,-7.75; PD8 4,7.75; PD9 3.5,7.75; PD10 3,7.75; PD11 2.5,7.75; PD12 2,7.75; PD13 1.5,7.75; PD14 1,7.75; PD15 0.5,7.75; PE2 -6,-7.75; PE3 -5.5,-7.75; PE4 -5,-7.75; PE5 -4.5,-7.75; PE6 -4,-7.75; PH0 -0.5,-7.75; PH1 0,-7.75; VBAT -3.5,-7.75; VCAP2 -5,7.75; VDD1 -1,-7.75; VDD2 3,-7.75; VDD5 -6,7.75; VDDA 4.5,-7.75; VREF+ 4,-7.75; VSS1 -1.5,-7.75; VSS3 -5.5,7.75; VSSA 3.5,-7.75

### Placement (x,y rotation side)
49.9  76.83,33.34 180 top
C1  74.3,48.9 270 top
C2  55.88,26.67 180 top
C3  59.05,18.41 180 top
C4  66.04,39.37 90 top
C5  55.24,15.24 270 top
C6  59.05,16.51 180 top
C7  53.66,37.15 270 top
C8  50.8,36.83 180 top
C9  50.8,44.45 180 top
C10  18.73,51.75 90 top
C11  7.3,19.05 0 top
C12  10.79,21.27 0 top
C13  2.54,22.23 180 top
C14  37.78,36.51 270 top
C15  54.61,30.48 180 top
C16  44.77,9.84 90 top
C17  35.56,35.88 270 top
C18  53.34,32.38 180 top
C19  36.51,12.38 270 top
C20  38.73,15.88 0 top
C21  46.04,13.65 90 top
C22  53.66,20 180 top
C23  31.43,19.37 0 top
C24  48.26,13.65 90 top
CTS1  40.64,11.75 180 top
D1  38.73,47.62 180 top
J1  17.14,53.34 270 top
J2  12.7,10.79 0 top
J3  26.99,52.07 180 top
JP1  81.6,50.48 180 top
JP2  72.39,6.03 0 top
JP3  55.88,52.39 0 top
JP4  55.88,38.1 0 top
JP5  55.88,41.91 0 top
JP6  55.88,45.4 0 top
JP7  66.67,52.39 0 top
JP8  55.88,3.81 180 top
JP9  2.54,28.26 0 top
JP10  66.67,3.81 180 top
JP11  2.54,33.66 0 top
JP12  55.88,34.61 0 top
JP13  66.67,9.53 180 top
JP14  23.18,25.4 0 top
JP15  33.34,35.56 0 top
JP16  27.62,11.43 0 top
JP17  44.13,3.81 180 top
JP18  34.29,52.39 0 top
JP19  29.53,16.19 180 top
JP20  23.5,29.53 0 top
JTAG1  16.51,33.02 270 top
LED1  73.98,10.48 270 top
LED2  73.34,33.34 270 top
LED3  32.7,12.7 180 top
LED4  33.97,12.7 180 top
LED5  35.24,12.7 180 top
Q1  61.91,15.24 270 top
R1  59.37,29.21 0 top
R2  60.96,30.8 0 top
R3  53.66,24.13 0 top
R4  60.96,32.38 0 top
R5  53.66,22.86 0 top
R6  61.28,25.4 270 top
R7  59.05,27.62 0 top
R8  67.31,33.66 90 top
R9  59.05,25.4 90 top
R10  70.17,33.66 90 top
R11  76.83,10.48 180 top
R13  10.79,36.83 180 top
R14  9.21,30.8 0 top
R15  4.45,30.8 0 top
R16  44.77,13.34 270 top
R17  32.7,9.84 90 top
R18  33.97,9.84 90 top
R19  35.24,9.84 90 top
TP1  31.75,50.8 0 top
TP2  44.45,14.92 0 top
TP6  26.35,46.99 0 top
TP7  27.62,46.99 0 top
U1  77.15,40.32 270 top
U2  73.98,20.64 270 top
U3  50.8,40.64 0 top
U4  6.67,23.18 0 top
U5  42.86,25.08 0 top

### Tracks (layer width: path | path; a pad name or v marks a point on that pad's centre or on a via)
3.3V  (via drill 0.33 pad 0.69)
  Top 0.203: U5.VCAP2 37.86,34.21 v37.78,34.29 C14.2 | U5.VDD5 36.83,32.87 v36.83,34.29 36.5,34.29 C17.2 | U5.VDD4 50.65,31.11 v52.39,31.11 52.69,31.42 C18.2 | U5.VCAP1 51.97,30.58 v52.39,30.16 52.7,30.48 C15.2 | U5.VDD6 34.01,19.08 v33.66,19.37 33.34,19.05 32.4,19.05 C23.2 | U5.VDD2 45.86,16.05 v45.72,15.88 C21.2 | U5.VDD3 51.97,20.1 v52.07,20 C22.2 | C24.2 48.26,14.92 v47.31,15.24 47.36,15.61 U5.VDDA | U5.VDD1 41.86,16.46 v40.96,15.88 C20.2 | R14.2 10.16,31.1 JP11.4 10.16,34.61 9.21,35.56 | R15.2 v6.35,30.8 | U4.4 3.39,22.43 | 3.39,22.43 C13.1 3.39,22.43 | U4.2 4.39,23.43 3.39,22.43 | 3.39,22.43 3.39,23.28 v3.17,23.5 | U4.13 7.42,25.6 v7.3,25.72 | v35.24,8.26 R19.1 | R18.1 v33.97,8.26 | R17.1 v32.7,8.26 | 9.21,35.56 5.71,35.56 4.45,36.83 4.45,45.98 J1.4 | C10.2 v18.73,53.34 | R13.2 10.14,36.5 9.21,35.56 | U3.13 53,39.39 v53.66,38.73 | v53.66,38.73 C7.1 | LED2.A 71.62,34.3 R10.2 R8.2 63.55,34.3 JP12.4 63.5,37.15 64.87,38.52 C4.1 66.14,38.62 U1.4 | JP3.2 58.42,52.07 53.98,47.62 53.98,39.05 v53.66,38.73 | R16.2 44.77,12.06 v46.04,10.79
  other vias: 4.45,46.04
  pour PWR: 0.95,54.61 1.27,0.95 67.94,0.64 67.94,11.75 54.93,11.75 53.34,13.34 53.34,16.51 56.52,19.68 56.52,21.59 61.59,26.67 63.82,26.67 67.94,30.8 67.94,39.05 61.28,45.72 35.56,45.72 26.67,54.61
CP
  Top 0.203: U2.11 62.89,17.64 Q1.1
CS
  Top 0.203: R7.2 R9.2 59.07,26.04 59.69,26.04 60.33,25.4 60.33,21.59 61.28,20.64 U2.8
DIR  (via drill 0.33 pad 0.69)
  Top 0.203: U5.PE11 45.62,27.08 v44.45,28.26
  Bottom 0.203: v44.45,28.26 44.45,44.77 46.67,46.99 48.58,48.9 53.34,48.9 55.88,51.44 JP3.1
ENA  (via drill 0.33 pad 0.69)
  Top 0.203: R2.2 62.23,30.5 62.23,24.13 62.72,23.64 U2.5 66.5,23.64 v66.67,23.81 | R10.1 v70.17,31.43
  Bottom 0.203: v70.17,31.43 70.17,27.3 v66.67,23.81
ENB  (via drill 0.33 pad 0.69)
  Top 0.203: R3.2 56.83,24.13 61.33,19.64 U2.9 66.63,19.64 v66.67,19.68 | v67.31,31.43 R8.1
  Bottom 0.203: v66.67,19.68 66.04,19.68 65.41,20.32 65.41,29.53 v67.31,31.43
ESCA  (via drill 0.33 pad 0.69)
  Top 0.203: U5.PE15 49.02,29.08 v48.58,29.53
  Bottom 0.203: JP4.1 55.24,38.1 52.39,35.24 48.26,31.11 48.26,29.84 v48.58,29.53
ESCB  (via drill 0.33 pad 0.69)
  Top 0.203: U5.PE14 47.94,28.58 v47.31,29.21
  Bottom 0.203: JP5.1 54.61,41.91 52.39,39.69 52.39,36.2 49.21,33.02 47.62,33.02 46.99,32.38 46.99,29.53 v47.31,29.21
ESCC  (via drill 0.33 pad 0.69)
  Top 0.203: U5.PE13 47.16,28.08 v46.67,28.57
  Bottom 0.203: JP6.1 55.88,46.04 54.93,46.99 48.26,46.99 45.72,44.13 45.72,29.53 v46.67,28.57
ESCD  (via drill 0.33 pad 0.69)
  Top 0.203: U5.PE12 46.4,27.58 v45.72,28.26
  Bottom 0.203: v45.72,28.26 45.09,28.89 45.09,44.45 48.9,48.26 54.61,48.26 62.55,48.26 JP7.1
FS_DM  (via drill 0.33 pad 0.69)
  Top 0.203: 27.64,47.64 TP7.TP | U5.PA11 39.36,34.28 39.69,34.61 40.01,34.92 40.01,38.1 40.01,38.42 38.42,40.01 31.75,40.01 29.84,41.91 v28.89,41.91
  Top 0.254: 27.64,47.01 TP7.TP v28.89,46.99 | 27.64,47.64 J3.P2
  Bottom 0.254: v28.89,41.91 28.89,42.86 28.89,44.77 28.89,46.04 v28.89,46.99
FS_DP  (via drill 0.33 pad 0.69)
  Top 0.203: U5.PA12 38.86,34.42 39.37,34.92 39.37,38.1 38.73,38.73 31.75,38.73 v31.43,39.05 | v31.75,49.53 31.75,50.16 TP1.TP
  Top 0.254: TP1.TP 27.62,50.8 26.99,50.16 J3.P3
  Bottom 0.203: v31.43,39.05 31.43,44.13 31.43,45.72 31.75,46.04 v31.75,49.53
FS_ID  (via drill 0.33 pad 0.69)
  Top 0.203: 26.34,47.96 TP6.TP v24.45,46.99 | U5.PA10 39.86,34.15 40.64,34.92 40.64,38.73 39.69,39.69 38.73,40.64 32.07,40.64 30.16,42.55 26.99,42.55 26.04,43.5 v24.45,45.09
  Top 0.254: 26.34,47.96 J3.P4
  Bottom 0.203: v24.45,46.99 v24.45,45.09
FS_VBUS  (via drill 0.33 pad 0.69)
  Top 0.203: U5.PA9 40.36,34.01 41.27,34.92 41.27,39.69 40.64,40.32 40.32,40.32 38.42,42.23 31.11,42.23 v29.84,43.5
  Top 0.254: D1.A 31.43,47.62 v29.53,47.62 | v29.53,47.62 29.37,47.78 v29.53,47.62 | J3.P1 28.29,48.87 v29.53,47.62
  Bottom 0.203: v29.84,43.5 29.84,47.31 v29.53,47.62
GND  (via drill 0.33 pad 0.69)
  Top 0.203: U5.VSS3 37.36,31.54 v37.47,31.43 | U5.VSS2 49.31,19.58 v49.21,19.68 | U5.VREF+ 46.86,18.29 v47.31,18.73 | U5.VSSA 46.36,18.73 v46.35,18.73 | U5.VSS1 41.36,18.5 41.36,19.45 v41.91,20 | C18.1 v54.93,32.38 | C15.1 55.46,31.33 v55.88,31.75 | v55.24,20 C22.1 | v46.04,11.75 C21.1 | C24.1 v48.26,11.75 | C20.1 37.15,15.88 v36.83,15.56 | C19.1 36.51,13.34 v36.51,13.97 | C16.1 v44.77,7.94 | U4.9 8.78,22.43 v9.21,22.86 8.64,23.43 U4.11 | C13.2 v0.95,22.23 | C11.2 v9.21,19.05 | v29.84,19.37 C23.1 | JTAG1.5 JTAG1.3 12.7,34.29 v12.06,34.92 | v14.61,28.89 14.61,29.47 JTAG1.9 | J1.MT2 2.71,33.82 JP11.1 | J1.6 5.09,49.84 4.76,50.16 v4.76,51.44 4.76,51.78 J1.MT1 | v15.24,51.44 15.34,51.34 J1.CD1 16.94,51.1 C10.1 | J1.CD2 15.3,45.34 v15.24,45.4 | v50.16,35.56 50.16,36.81 C8.2 | v48.9,44.45 50.16,44.47 C9.2 | U3.1 49.51,41.89 v49.85,40.96 | U3.18 52.05,41.89 v51.75,41.59 | v53.66,35.56 C7.2 | R1.1 59.37,28.89 v57.47,28.89 | C2.2 v54.29,26.04 | R9.1 v57.78,24.77 | 74.3,35.88 77.15,38.73 | 77.15,38.73 U1.6 | U1.3 68.58,40.32 | 68.58,40.32 67.63,40.32 66.99,40.64 66.46,40.64 C4.2 | R11.1 77.47,10.48 77.47,9.21 77.47,7.43 JP2.2 | C3.2 58.1,18.41 57.15,17.46 57.15,16.77 | 49.9.1 77.48,38.4 77.15,38.73 | v73.34,40.64 68.9,40.64 68.58,40.32 | C14.1 36.62,37.36 v36.2,37.78 35.56,37.15 C17.1
  Top 0.254: 57.15,16.77 58.14,16.77 C6.2
  Top 1.524: C1.2 74.3,35.88
  other vias: 84.77,16.83 85.72,17.14 85.72,16.19 84.77,15.88 84.77,25.4 84.77,24.45 85.72,24.13 85.72,25.08 73.34,42.55 73.34,43.5 73.34,44.45 73.34,41.59 73.34,39.69 73.34,38.73 73.34,37.78 73.34,36.83 73.34,35.88 39.69,31.11 39.05,27.3 41.91,26.99 39.69,26.04 41.91,25.4 44.77,24.13 48.58,23.5 46.67,24.13 47.31,21.91 59.05,23.5 64.45,6.99 68.26,6.99 47.62,8.89 27.62,8.57 28.89,7.94 25.72,3.49 40.32,7.94 37.15,8.57 56.83,21.91 55.88,23.5 80.64,31.75 84.45,32.7 86.36,38.73 86.04,44.13 86.04,50.48 59.05,49.53 61.91,49.53 46.67,40.96 8.57,47.62 2.54,50.48 2.54,44.45 6.99,37.15 7.94,41.59 2.54,37.78 2.22,24.13 19.37,16.83 15.56,14.92 27.3,24.45 33.66,41.59 36.51,41.59
  pour GND: 1.27,54.61 0.95,1.27 90.49,1.27 90.49,54.61
  pour Top: 84.14,23.5 86.04,23.5 86.36,23.81 86.36,25.4 85.72,26.04 81.6,26.04 81.28,25.72 81.28,23.81 81.6,23.5
  pour Top: 84.77,17.78 81.92,17.78 81.28,17.14 81.28,15.88 81.92,15.24 85.72,15.24 86.36,15.88 86.36,17.46 86.04,17.78 85.09,17.78
  pour Top: 73.66,45.4 73.03,45.4 72.39,44.77 72.39,35.88 73.03,35.24 82.87,35.24 83.5,35.88 83.5,44.45 82.55,45.4
  pour Top: 0.32,54.93 0.32,0.64 0.64,0.32 87.31,0.32 88.58,1.59 88.58,2.86 87.63,3.81 73.66,3.81 73.34,4.13 73.34,9.84 72.07,11.11 63.18,11.11 61.59,12.7 59.05,12.7 57.78,11.43 53.98,11.43 53.66,12.06 53.66,14.92 55.56,15.56 57.15,17.46 59.05,17.46 59.05,20.64 57.78,21.91 62.23,21.91 62.55,22.23 62.55,29.84 62.87,30.48 87.63,30.48 87.63,53.02 86.68,54.29 81.92,54.29 80.33,52.7 80.33,48.58 81.92,46.99 83.19,46.99 84.77,45.4 84.77,35.56 83.5,34.29 69.22,34.29 66.67,36.83 66.67,39.69 64.14,42.23 64.14,53.98 63.18,54.93
IMU_CLKOUT
  Top 0.203: U3.22 50.55,43.11 50.16,43.5 47.62,43.5 46.04,41.91 45.86,41.73 U5.PD10
IMU_FSYNC  (via drill 0.33 pad 0.69)
  Top 0.203: U5.PD9 46.36,36.84 v46.67,37.15 | U3.11 51.55,39.26 51.44,39.37 v51.12,39.69
  Bottom 0.203: v51.12,39.69 49.85,39.69 48.9,38.73 48.26,38.73 v46.67,37.15
IMU_INT
  Top 0.203: U5.PD8 46.86,31.88 47.62,31.11 49.21,31.11 50.8,32.7 52.05,33.95 52.07,33.97 52.39,34.29 52.39,37.15 52.05,37.48 U3.12
INA
  Top 0.203: U2.4 62.99,24.64 62.87,24.77 62.87,31.13 R4.2
INB
  Top 0.203: R5.2 57.15,22.86 | U2.10 64.77,18.73
  Top 0.254: 57.15,22.86 59.69,20.32 60.64,19.37 60.96,19.05 63.5,19.05 63.82,18.73 64.77,18.73
LED_B  (via drill 0.33 pad 0.69)
  Top 0.203: U5.PC15 40.86,19.27 40.86,19.91 41.27,20.32 v41.59,21.59 | LED5.A 35.24,14.29 v35.88,14.92
  Bottom 0.203: v35.88,14.92 36.51,14.92 37.15,14.61 39.69,14.61 40.01,14.92 40.01,16.16 40.86,17.02 40.86,19.27 40.86,19.91 41.27,20.32 v41.59,21.59
LED_G  (via drill 0.33 pad 0.69)
  Top 0.203: U5.PC14 40.36,20.68 v40.64,20.95 | LED4.A 33.97,13.97 v34.61,14.92
  Bottom 0.203: v34.61,14.92 35.88,16.19 36.2,16.51 39.54,16.51 U5.PC14 40.36,20.68 v40.64,20.95
LED_R  (via drill 0.33 pad 0.69)
  Top 0.203: U5.PC13 39.86,21.45 v40.32,22.23 | LED3.A 32.7,14.29 v33.02,14.61
  Bottom 0.203: v33.02,14.61 35.24,16.83 35.56,17.14 38.91,17.14 39.86,18.1 39.86,21.45 v40.32,22.23
MD_CS
  Top 0.203: U5.PB2 51.25,24.58 51.57,24.58 52.07,25.08 52.07,25.72 53.98,27.62 54.29,27.62 54.61,27.62 R7.1 C2.1
MD_CSDIS  (via drill 0.33 pad 0.69)
  Top 0.203: U5.PE8 49.35,25.58 v48.9,26.04 | U2.6 63.09,22.64 v62.55,22.86
  Bottom 0.203: v48.9,26.04 53.34,26.04 53.98,25.4 55.56,25.4 58.1,22.86 v62.55,22.86
MD_ENA
  Top 0.203: R2.1 58.42,30.8 56.2,28.57 54.29,28.57 52.07,26.35 51.8,26.08 51.7,26.08 U5.PE9
MD_ENB
  Top 0.203: U5.PB1 52.96,24.08 R3.1
MD_INA
  Top 0.203: U5.PE10 51.35,26.58 52.07,27.3 53.98,29.21 56.2,29.21 58.1,31.11 59.05,32.07 R4.1
MD_INB
  Top 0.203: U5.PB0 52.28,23.58 R5.1
MD_PWM  (via drill 0.33 pad 0.69)
  Top 0.203: U5.PE7 48.26,25.08 v47.31,26.04 | R1.2 v61.28,28.89 61.28,27.3 R6.1
  Bottom 0.203: v47.31,26.04 47.31,26.35 47.94,26.99 54.29,26.99 57.15,29.84 60.96,29.84 v61.28,28.89
N$1  (via drill 0.33 pad 0.69)
  Top 0.203: U5.PA8 40.86,33.88 41.91,34.92 41.91,40.64 41.27,41.27 40.32,41.27 38.42,43.18 v34.92,43.18
  Bottom 0.203: v34.92,43.18 34.92,44.45 34.92,45.09 34.29,45.72 JP18.1
N$2
  Top 0.203: 49.9.2 LED2.C
N$3
  Top 0.203: LED1.C R11.2
N$4
  Top 0.203: U4.12 10.68,23.93 11.75,22.86 11.75,21.57 C12.2
N$5
  Top 0.203: R17.2 LED3.C
N$6
  Top 0.203: LED4.C R18.2
N$7
  Top 0.203: LED5.C R19.2
N$9  (via drill 0.33 pad 0.69)
  Top 0.203: U5.PC0 43.86,19 v43.5,19.37
  Bottom 0.203: v43.5,19.37 42.55,18.41 42.55,11.43 39.37,8.26 36.83,5.71 36.83,4.13 36.64,3.94 JP17.4
N$10  (via drill 0.33 pad 0.69)
  Top 0.203: U5.PC1 44.36,21.04 v45.4,21.91
  Bottom 0.203: v45.4,21.91 44.45,20.95 44.45,17.78 43.18,16.51 43.18,8.57 42.23,7.62 39.69,5.08 39.69,4.32 JP17.3
N$11
  Top 0.203: C12.1 7.95,21.27 U4.8
N$12  (via drill 0.33 pad 0.69)
  Top 0.203: U4.10 7.05,22.93 v6.99,22.86 | v6.35,20.32 6.35,19.1 C11.1
  Bottom 0.203: v6.99,22.86 6.99,20.95 v6.35,20.32
N$14  (via drill 0.33 pad 0.69)
  Top 0.203: U5.PC2 44.86,20.1 v45.4,20.64
  Bottom 0.203: v45.4,20.64 44.86,20.1 U5.PC2 43.81,16.29 43.81,8.26 43.5,7.94 42.55,6.99 42.55,4.89 JP17.2
N$15
  Top 0.203: U5.PE1 29.29,20.08 28.89,19.68 28.89,17.78 28.89,17 JP19.1
N$16  (via drill 0.33 pad 0.69)
  Top 0.203: U5.PC3 45.36,19.33 v45.72,19.68
  Bottom 0.203: v45.72,19.68 45.4,19.37 45.4,16.83 44.77,16.19 44.77,9.21 45.72,7.94 45.72,4.45 45.09,3.81 44.26,3.81 JP17.1
N$18
  Top 0.203: U3.20 51.55,44.03 C9.1
N$20
  Top 0.203: JTAG1.1 12.71,35.56 R13.1
N$41
  Top 0.203: U5.PE2 36.41,17.78 32.7,17.78 32.07,17.14 32.07,14.29 30.16,12.38 30.16,11.56 JP16.2
N$42  (via drill 0.33 pad 0.69)
  Top 0.203: U5.PE3 37.36,17.88 v36.83,18.73 36.51,18.41 32.38,18.41 31.43,17.46 31.43,14.29 30.8,13.65 27.94,13.65 27.62,13.34 27.62,11.56 JP16.1
N$43  (via drill 0.33 pad 0.69)
  Top 0.203: U5.PE4 37.86,18.65 37.47,19.05 v37.47,20 | v25.4,20 25.08,19.68 25.08,8.57 27.62,6.03 27.62,4.95 JP17.7
  Bottom 0.203: v25.4,20 28.89,20 29.21,20.32 37.15,20.32 v37.47,20
N$44  (via drill 0.33 pad 0.69)
  Top 0.203: U5.PE5 38.36,19.31 v38.42,19.37 | v31.75,9.84 30.48,8.57 30.48,4.89 JP17.6
  Bottom 0.203: v31.75,9.84 31.75,15.24 33.34,16.83 34.29,17.78 38.05,17.78 38.36,18.1 38.36,19.31 v38.42,19.37
N$45  (via drill 0.33 pad 0.69)
  Top 0.203: U5.PE6 38.86,18.23 39.37,18.73 39.37,20.32 v39.05,20.64
  Bottom 0.203: v39.05,20.64 39.05,22.54 39.69,23.18 41.59,23.18 42.55,22.23 42.86,21.91 42.86,20 41.27,18.41 41.27,17.78 41.27,16.83 41.91,16.19 41.91,15.56 41.27,14.92 41.27,10.79 40.01,9.53 39.37,9.53 35.24,5.4 35.24,4.95 JP17.5
N$55  (via drill 0.33 pad 0.69)
  Top 0.203: U5.PC7 42.36,30.93 v41.27,29.84
  Bottom 0.203: v41.27,29.84 42.55,31.11 42.55,40.32 36.83,46.04 36.83,51.44 JP18.2
N$56  (via drill 0.33 pad 0.69)
  Top 0.203: U5.PC6 42.86,30.16 v42.55,29.84
  Bottom 0.203: v42.55,29.84 43.18,30.48 43.18,40.64 40.01,43.81 39.37,44.45 JP18.3
N$57  (via drill 0.33 pad 0.69)
  Top 0.203: U5.PD15 43.36,29.07 v43.18,28.89
  Bottom 0.203: v43.18,28.89 43.81,29.53 43.81,40.96 40.96,43.81 40.96,49.85 41.91,50.8 JP18.4
N$58
  Top 0.203: U5.PD14 43.86,43.23 43.86,44.5 46.04,46.67 46.04,48.58 45.09,49.53 45.09,51.88 JP18.5
N$59
  Top 0.203: U5.PD13 44.36,43.41 44.36,44.36 46.67,46.67 46.67,49.85 47.62,50.8 47.62,51.63 JP18.6
N$60
  Top 0.203: U5.PD12 44.86,43.91 44.86,44.23 47.31,46.67 47.31,47.94 48.9,49.53 50.16,51.12 50.16,51.88 JP18.7
N$61
  Top 0.203: U5.PD11 45.36,43.77 45.36,44.09 47.94,46.67 47.94,47.31 50.16,49.53 51.75,49.53 52.7,50.48 52.7,51.63 JP18.8
N$66
  Top 0.203: U5.PE0 28.2,20.58 27.3,19.68 27.3,16.69 JP19.2
N$67
  Top 0.203: U5.PB5 24.04,23.58 23.18,24.45 JP14.1
N$68  (via drill 0.33)
  Top 0.203: U5.PB4 33.07,24.08 32.7,24.45 v32.7,24.77
  Bottom 0.203: v32.7,24.77 32.7,25.72 31.75,26.67 29.21,26.67 28.89,26.99 27.62,26.99 27.3,26.67 27.11,26.67 JP14.2
N$69  (via drill 0.33 pad 0.69)
  Top 0.203: U5.PD7 33.97,25.08 v33.66,24.77
  Bottom 0.203: v33.66,24.77 32.7,23.81 30.48,23.81 29.97,23.81 JP14.3
N$70
  Top 0.203: U5.PD6 31.93,25.58 31.11,25.58 JP14.4
N$71
  Top 0.203: U5.PD5 33.61,26.08 32.38,27.3 27.94,27.3 27.3,26.67 24.45,26.67 23.81,27.3 23.18,27.94 23.18,29.34 JP20.1
N$72  (via drill 0.33 pad 0.69)
  Top 0.203: U5.PD4 36.28,26.58 v36.83,26.04 | v26.04,27.3 26.04,28.89 JP20.2
  Bottom 0.203: v26.04,27.3 26.67,27.3 26.99,27.62 29.21,27.62 29.53,27.3 32.38,27.3 33.66,26.04 v36.83,26.04
N$73
  Top 0.203: U5.PD3 33.88,27.08 33.02,27.94 29.84,27.94 28.89,28.89 28.89,29.34 JP20.3
N$74
  Top 0.203: U5.PD1 33.83,28.08 33.66,28.26 32.7,29.21 32.38,29.53 31.24,29.53 JP20.4
N$75
  Top 0.203: U5.PD0 35.88,28.58 36.2,28.57 38.73,28.57 39.37,29.21 39.37,29.84 38.73,30.48 37.47,30.48 36.51,31.43 36.51,31.75 36.2,32.07 36.2,33.66 35.56,34.29 34.61,34.29 JP15.1
NRST  (via drill 0.33 pad 0.69)
  Top 0.203: R16.1 44.45,14.3 TP2.TP 43.81,15.56 43.81,15.88 43.36,16.33 U5.NRST 43.36,18.23 42.55,19.05 42.55,19.68 43.18,20.32 43.18,21.27 43.5,21.59 v43.5,22.54 | J2.5 9.57,11.79 v18.1,20.32 | v18.1,24.13 18.1,30.22 JTAG1.10
  Bottom 0.203: v18.1,24.13 v18.1,20.32 21.59,20.32 22.86,21.59 36.83,21.59 38.73,23.81 42.23,23.81 42.55,23.5 v43.5,22.54
OSC_IN1
  Top 0.203: U5.PH0 42.36,16.38 42.23,16.19 42.23,15.24 42.23,14.92 40.32,14.92 40.01,14.61 40.01,11.48 CTS1.3 38.37,10.48 36.83,10.48 36.51,10.79 C19.2
OSC_OUT1
  Top 0.203: U5.PH1 42.86,15.88 43.18,15.24 42.86,14.92 42.23,14.29 40.96,14.29 40.64,13.97 40.64,12.7 41.59,11.75 42.27,11.75 CTS1.1 44.66,11.13 C16.2
OUTA
  Top 0.203: U2.25 79.73,22.64 U2.OUTA 77.48,27.14 U2.30
  pour Top: 63.5,27.62 63.18,27.94 63.18,28.89 63.82,29.53 87,29.53 88.27,28.26 88.27,6.35 87.95,5.4 87.31,4.76 82.55,4.76 81.28,6.03 81.28,9.84 82.55,11.11 86.04,11.11 87,12.38 87,25.72 85.41,27.3 80.96,27.3 80.33,26.67 80.33,23.5 81.28,22.54 84.45,22.54 84.77,22.23 84.45,21.91 80.64,21.91 80.33,21.59 74.61,21.59 74.3,21.91 74.3,26.67 73.98,26.99 66.36,26.99 66.04,27.3 64.45,27.3
OUTB
  Top 0.203: U2.21 79.73,18.64 U2.OUTB 77.48,13.33 77.79,13.02 77.79,13.45 U2.16
  pour Top: 67.31,13.97 63.18,13.97 62.87,13.65 62.87,12.7 63.82,11.75 78.42,11.75 78.74,9.53 78.74,7.3 78.11,6.67 78.42,5.71 78.42,5.4 79.38,5.08 80.33,5.71 80.33,10.16 81.92,11.75 84.77,11.75 86.04,12.7 86.04,13.34 84.77,13.97 80.96,13.97 80.64,14.29 80.64,18.1 80.96,18.41 84.14,18.41 83.82,18.73 80.96,18.73 80.33,19.37 74.93,19.37 74.61,19.05 74.61,14.61 74.3,14.29 67.63,14.29
PWM
  Top 0.203: U2.7 61.55,21.64 61.28,21.91 R6.2
REGOUT
  Top 0.203: U3.10 51.05,37.85 51.44,37.47 51.44,36.84 C8.1
RX1
  Top 0.203: U5.PA1 48.36,16.41 48.9,15.88 50.16,14.61 50.16,6.6 JP8.2
RX2
  Top 0.203: U5.PA3 50.61,15.43 51.44,14.61 51.44,7.94 52.07,7.3 60.9,7.3 JP10.2
RX3  (via drill 0.33 pad 0.69)
  Top 0.203: U5.PB11 51.52,30.08 v52.7,28.89
  Bottom 0.203: JP12.2 58.42,33.34 54.93,29.84 53.66,29.84 v52.7,28.89
RX_DOUT1  (via drill 0.33 pad 0.69)
  Top 0.203: U5.PB7 34.01,22.58 33.66,22.23 14.29,22.23 v13.97,22.54
  Bottom 0.203: v13.97,22.54 13.97,21.59 12.06,19.68 9.53,17.14 2.35,17.14 J2.2
SCL1  (via drill 0.33 pad 0.69)
  Top 0.203: JP11.2 4.45,32.77 4.45,32.07 3.79,31.42 R15.1 3.79,30.5 4.45,29.84 4.45,28.64 JP9.2 5.3,27.79 U4.1 5.09,24.13 v4.45,24.77 | U5.PB8 13.66,21.58 13.02,22.23 13.02,23.5 v11.75,24.77
  Bottom 0.203: v11.75,24.77 v4.45,24.77
SDA1
  Top 0.203: JP11.3 7.62,31.73 R14.1 8.56,29.2 JP9.3 | U4.16 5.92,25.92 6.67,26.67 6.67,27.3 JP9.3 | U5.PB9 13.53,21.08 12.38,22.23 12.38,22.86 9.53,25.72 8.89,25.72 7.62,26.99 JP9.3
SDIO_CLK  (via drill 0.33 pad 0.69)
  Top 0.203: U5.PC12 33.78,29.08 33.02,29.84 33.02,30.16 32.38,30.8 30.8,30.8 v30.16,31.75 | J1.5 10.63,48.74 15.56,43.81 20.32,43.81 22.86,41.27 29.53,41.27 30.16,40.64 v30.16,36.51
  Bottom 0.203: v30.16,36.51 v30.16,31.75
SDIO_CMD  (via drill 0.33 pad 0.69)
  Top 0.203: U5.PD2 36.55,27.58 v36.83,27.3 | J1.3 10.93,46.54 14.61,42.86 20.32,42.86 v21.59,41.59
  Bottom 0.203: v36.83,27.3 33.66,27.3 33.02,27.94 30.8,27.94 30.48,28.26 28.26,28.26 27.94,28.26 26.99,28.26 26.35,27.94 24.77,27.94 24.13,27.3 22.23,27.3 21.59,27.94 v21.59,41.59
SDIO_D0
  Top 0.203: J1.7 10.97,50.94 14.92,46.99 19.68,46.99 20.64,46.04 30.16,46.04 31.11,45.09 37.78,45.09 42.55,40.64 42.55,34.61 41.91,33.97 41.86,33.92 U5.PC8
SDIO_D1  (via drill 0.33 pad 0.69)
  Top 0.203: J1.8 10.82,52.04 15.24,47.62 20,47.62 v20.95,47.62 | U5.PC9 41.36,31.52 v41.27,31.43
  Bottom 0.203: v20.95,47.62 20.95,44.45 23.5,41.91 23.5,32.07 24.45,31.11 32.07,31.11 33.97,29.21 34.61,28.57 38.73,28.57 v41.27,31.43
SDIO_D2  (via drill 0.33 pad 0.69)
  Top 0.203: U5.PC10 35.96,30.08 v36.51,29.53 | J1.1 10.59,44.34 13.97,40.96 20,40.96 22.23,38.73 v29.21,38.73
  Bottom 0.203: v29.21,38.73 30.16,38.73 31.11,37.78 31.11,33.34 34.29,30.16 35.88,30.16 v36.51,29.53
SDIO_D3  (via drill 0.33 pad 0.69)
  Top 0.203: U5.PC11 33.92,29.58 33.66,29.84 33.66,30.16 32.7,31.11 31.43,32.38 31.11,32.7 v27.62,32.7 | J1.2 10.76,45.44 14.29,41.91 20,41.91 21.91,40.01 27.3,40.01 v27.62,39.69
  Bottom 0.203: v27.62,39.69 v27.62,32.7
SPI1_MISO  (via drill 0.33 pad 0.69)
  Top 0.254: U5.PA6 53.98,21.58 v54.29,21.27
  Bottom 0.254: JP13.3 61.59,9.84 59.37,12.06 59.37,17.46 55.56,21.27 v54.29,21.27
SPI1_MOSI  (via drill 0.33 pad 0.69)
  Top 0.254: U5.PA7 55.39,22.08 v55.56,21.91
  Bottom 0.254: v55.56,21.91 60.01,17.46 60.01,12.06 60.64,11.43 62.48,11.43 JP13.2
SPI1_NSS  (via drill 0.33 pad 0.69)
  Top 0.203: U5.PA4 48.84,20.58 v48.58,20.32
  Bottom 0.203: v48.58,20.32 48.58,19.37 48.9,19.05 56.52,11.43 JP13.5
SPI1_SCK  (via drill 0.33 pad 0.69)
  Top 0.254: U5.PA5 52.9,21.08 v53.02,20.95
  Bottom 0.254: v53.02,20.95 53.34,20.64 55.56,20.64 58.74,17.46 58.74,10.1 JP13.4
SPI2_CS
  Top 0.203: U5.PB12 48.86,36.8 49.85,37.78 50.05,37.98 U3.8
SPI2_MISO
  Top 0.203: U5.PB14 47.86,32.15 48.26,31.75 48.9,31.75 49.21,31.75 50.48,33.02 50.48,34.92 50.8,35.24 50.8,37.47 50.55,37.72 U3.9
SPI2_MOSI
  Top 0.203: U3.24 47.62,42.62 47.36,42.35 47.36,40.06 46.99,39.69 46.99,38.42 47.31,38.1 47.36,38.05 U5.PB15
SPI2_SCK  (via drill 0.33 pad 0.69)
  Top 0.203: U3.23 50.05,42.02 50.16,41.91 50.48,41.91 50.8,41.59 v50.8,41.27 | v47.73,39.16 47.73,38.95 48.26,38.42 48.36,38.31 U5.PB13
  Bottom 0.203: v47.73,39.16 48.36,39.79 48.9,40.32 50.16,40.32 50.8,40.96 v50.8,41.27
TCK
  Top 0.203: JTAG1.4 30.64,34.29 31.11,34.29 33.66,31.75 34.32,31.08 U5.PA14
TDI
  Top 0.203: U5.PA15 33.87,30.58 30.8,33.66 24.13,33.66 22.23,31.75 JTAG1.8
TDO  (via drill 0.33 pad 0.69)
  Top 0.203: U5.PB3 36.33,24.58 36.78,24.13 v36.83,24.13 | JTAG1.6 v20.64,33.02
  Bottom 0.203: v20.64,33.02 20.64,25.4 22.86,22.86 36.2,22.86 36.83,23.5 v36.83,24.13
TMS  (via drill 0.33 pad 0.69)
  Top 0.203: JTAG1.2 30.8,35.56 33.66,32.7 34.92,32.7 35.88,31.75 35.88,31.43 37.78,29.53 v38.1,29.53 | U5.PA13 38.36,31.8 v38.73,31.43
  Bottom 0.203: v38.1,29.53 38.73,30.16 v38.73,31.43
TX1
  Top 0.203: U5.PA0 47.86,16.59 47.86,15.96 48.26,15.56 48.58,15.24 48.9,15.24 49.53,14.61 49.53,11.43 49.53,5.71 50.8,4.45 JP8.3
TX2
  Top 0.203: U5.PA2 48.86,16.54 50.77,14.64 50.8,6.67 59.05,6.67 61.59,4.13 JP10.3
TX3  (via drill 0.33 pad 0.69)
  Top 0.203: U5.PB10 51.38,29.58 51.75,29.21 51.75,28.57 v52.07,28.26
  Bottom 0.203: JP12.3 60.64,34.61 60.64,33.97 59.05,32.38 58.42,32.38 55.88,29.84 53.66,27.62 52.7,27.62 v52.07,28.26
TX_DIN1  (via drill 0.33 pad 0.69)
  Top 0.203: U5.PB6 33.56,23.08 33.34,22.86 15.56,22.86 v15.24,23.18
  Bottom 0.203: v15.24,23.18 15.24,21.91 12.06,18.73 8.57,15.24 2.42,15.24 J2.3
VCC
  Top 0.254: U2.13 63.26,15.64 62.55,15.24 60.96,15.24 59.69,15.24 59.69,16.5 C6.1
  pour Top: 61.59,14.92 61.28,14.92 60.33,15.88 59.69,15.88 59.37,16.19 59.37,16.51 59.05,16.83 57.78,16.83 55.88,14.92 54.29,14.61 54.29,12.06 57.78,12.06 59.05,13.34 60.01,13.65 61.28,13.65 61.59,13.97
VIN  (via drill 0.33 pad 0.69)
  Top 0.203: 63.5,16.51 63.63,16.64 U2.12 66.48,16.64 v66.67,16.83 | 75.03,50.48 C1.1 | C3.1 59.7,19.04 v59.37,19.37 59.05,19.68 v58.74,20 58.42,20.32 v58.1,20.64 | v44.45,46.99 44.45,47.31 44.13,47.62 | LED1.A v71.75,10.48 | 59.7,17.77 60.96,16.51
  Top 0.254: C3.1 59.7,17.77 | 60.96,16.51 63.18,16.51 63.5,16.51 64.14,16.51 64.77,16.51 65.41,16.51
  Top 2.032: JP1.2 75.03,50.48
  Top 2.54: D1.C 44.13,47.62 44.45,47.62
  other vias: 43.18,48.26 44.45,48.26 43.18,46.99 65.72,44.45 65.72,43.18 65.72,45.72 67.94,46.99 67.94,45.4 69.53,45.4 66.67,45.09 70.48,46.67 67.63,48.58 71.12,48.58 65.72,48.26 69.53,48.58 65.72,46.99 70.48,10.48 70.48,9.21 71.75,9.21 71.75,8.26 70.48,7.94
  pour PWR: 42.23,49.85 41.59,49.85 40.32,48.58 40.32,46.99 40.96,46.35 61.59,46.35 68.58,39.37 68.58,30.48 63.82,25.72 61.59,25.72 57.15,21.27 57.15,19.37 53.98,16.19 53.98,13.65 55.24,12.38 68.58,12.38 68.58,0.95 68.9,0.64 89.85,0.64 90.49,1.27 90.49,51.44 87.95,53.98 46.35,53.98
  pour Top: 71.12,42.55 67.31,42.55 66.99,42.86 66.99,44.45 67.31,44.77 70.8,44.77 71.12,45.09 71.12,46.99 73.66,49.53 75.25,49.53 75.88,50.16 75.88,50.8 75.25,51.44 73.03,51.44 72.71,51.12 72.71,50.48 71.75,49.53 65.41,49.53 64.77,48.9 64.77,42.86 66.36,41.27 70.8,41.27 71.12,41.59